# EAGLE board UCirKitBreadboardBottom-0824 (EAGLE 6.5.0), part 1 of 4
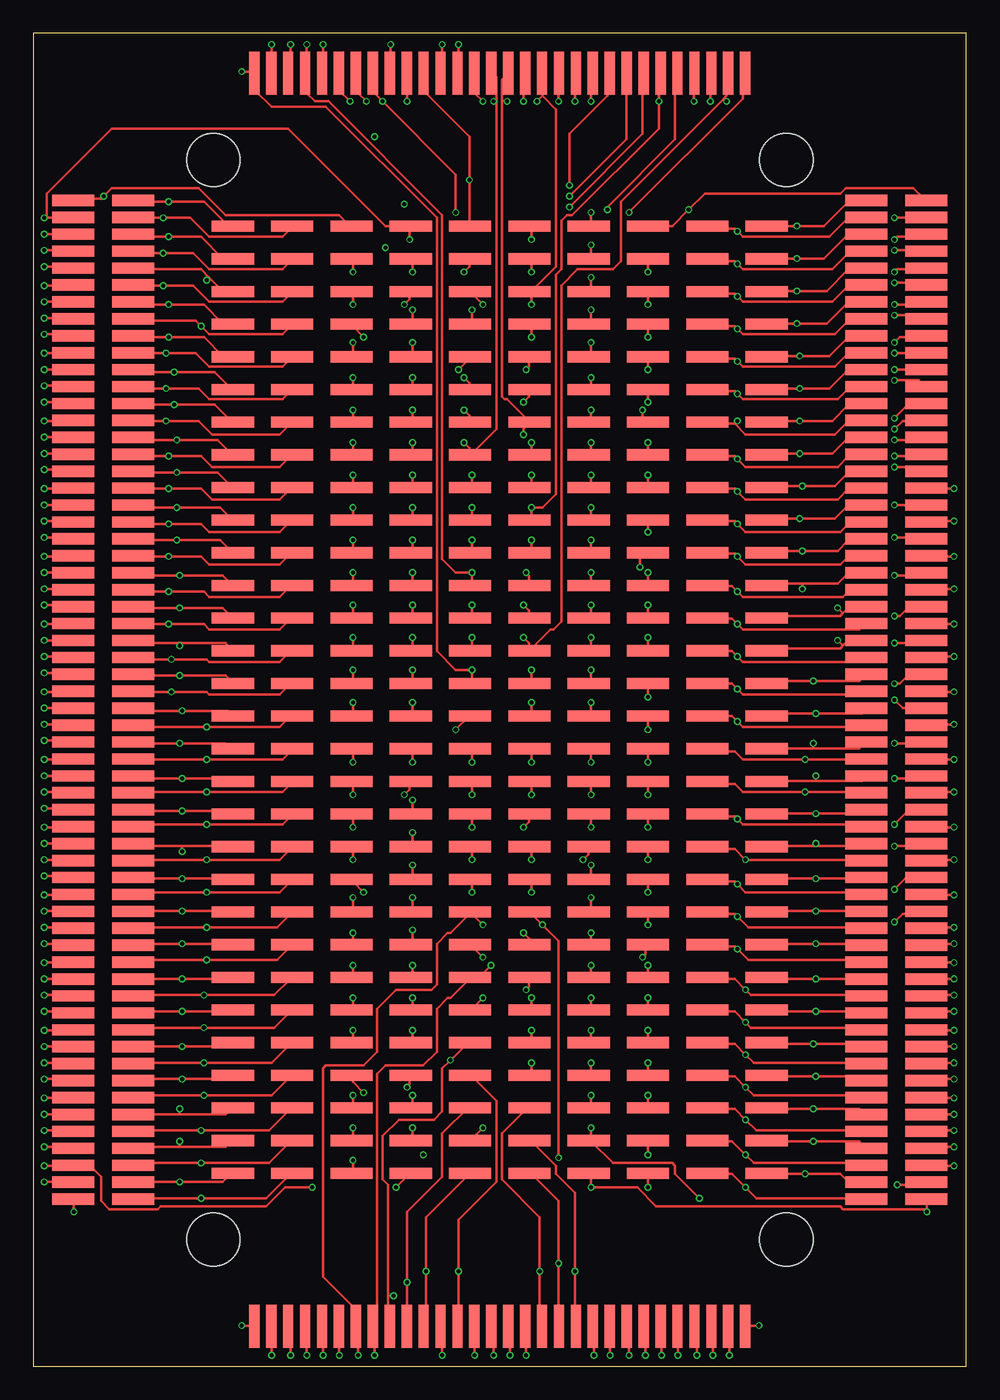
[diagram p5: board, top side]
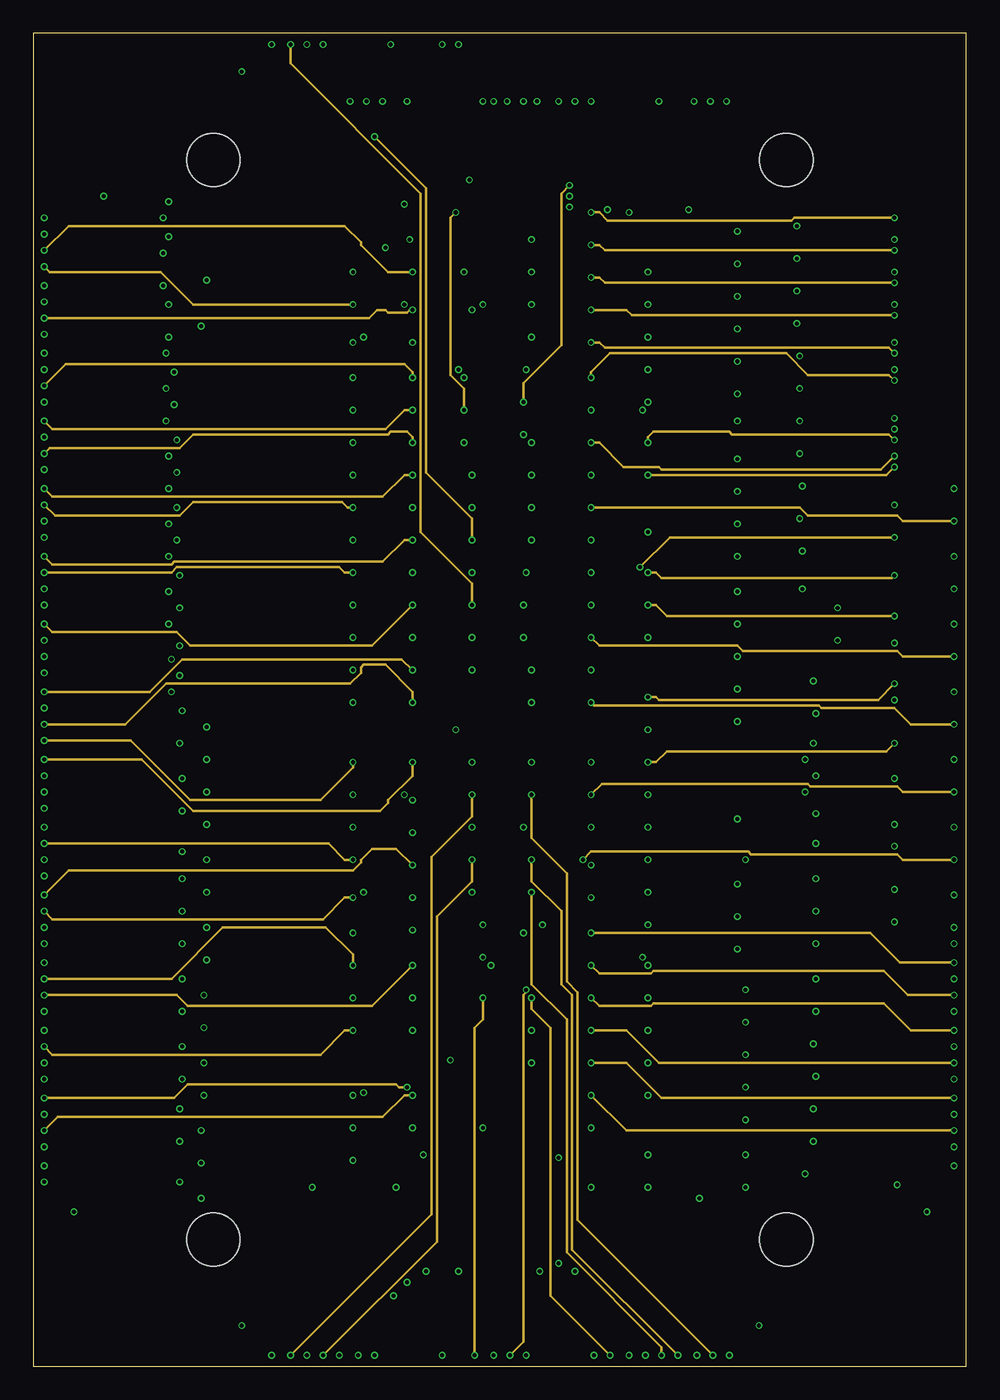
[diagram p6: board, inner layer Route2]
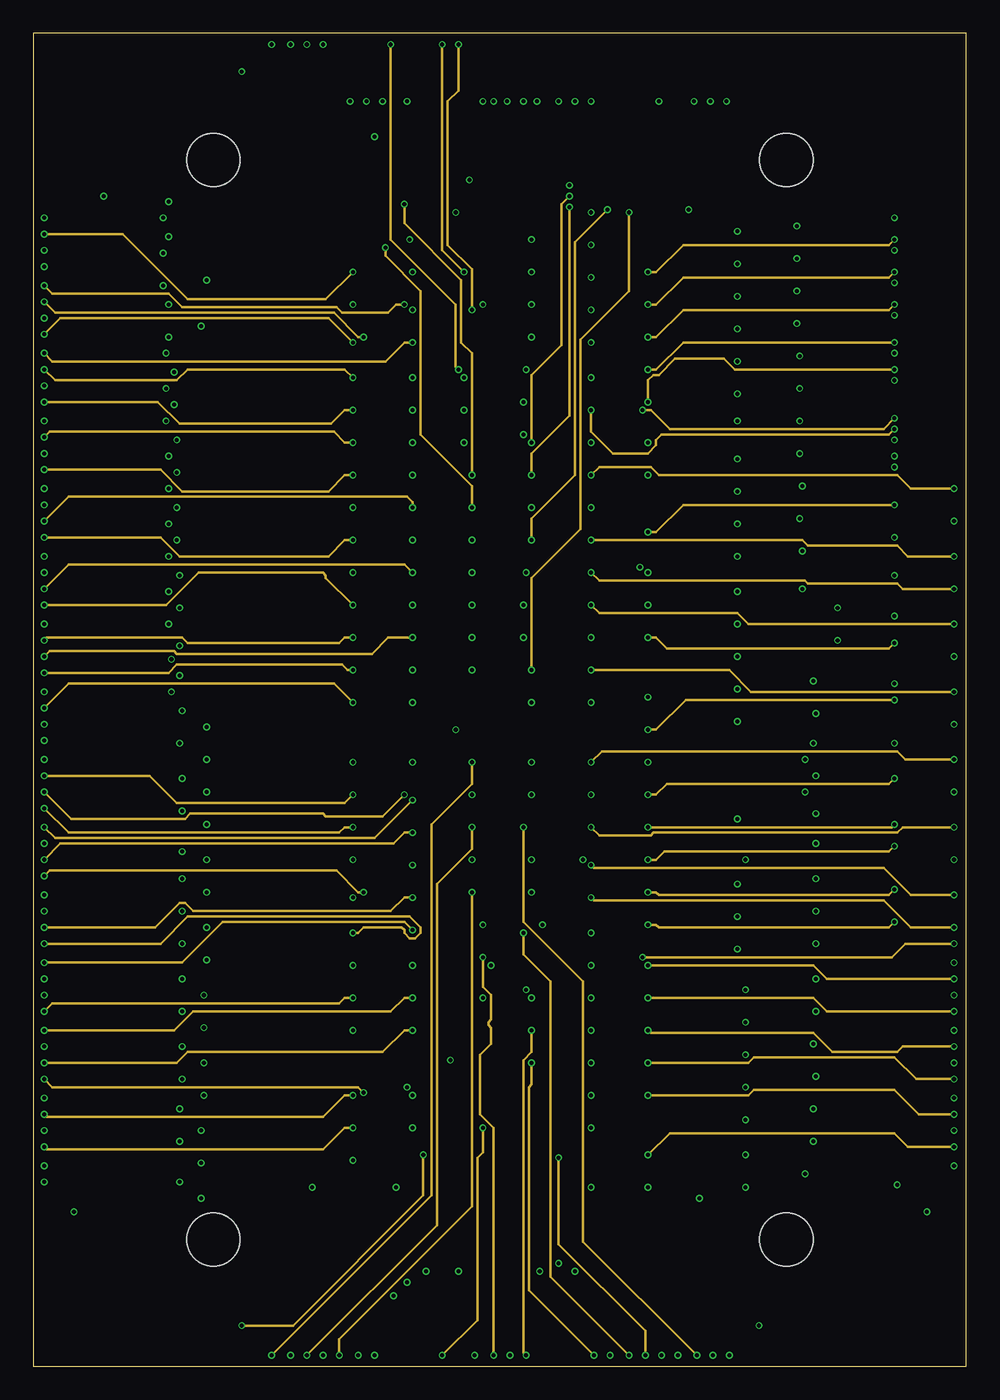
[diagram p7: board, inner layer Route15]
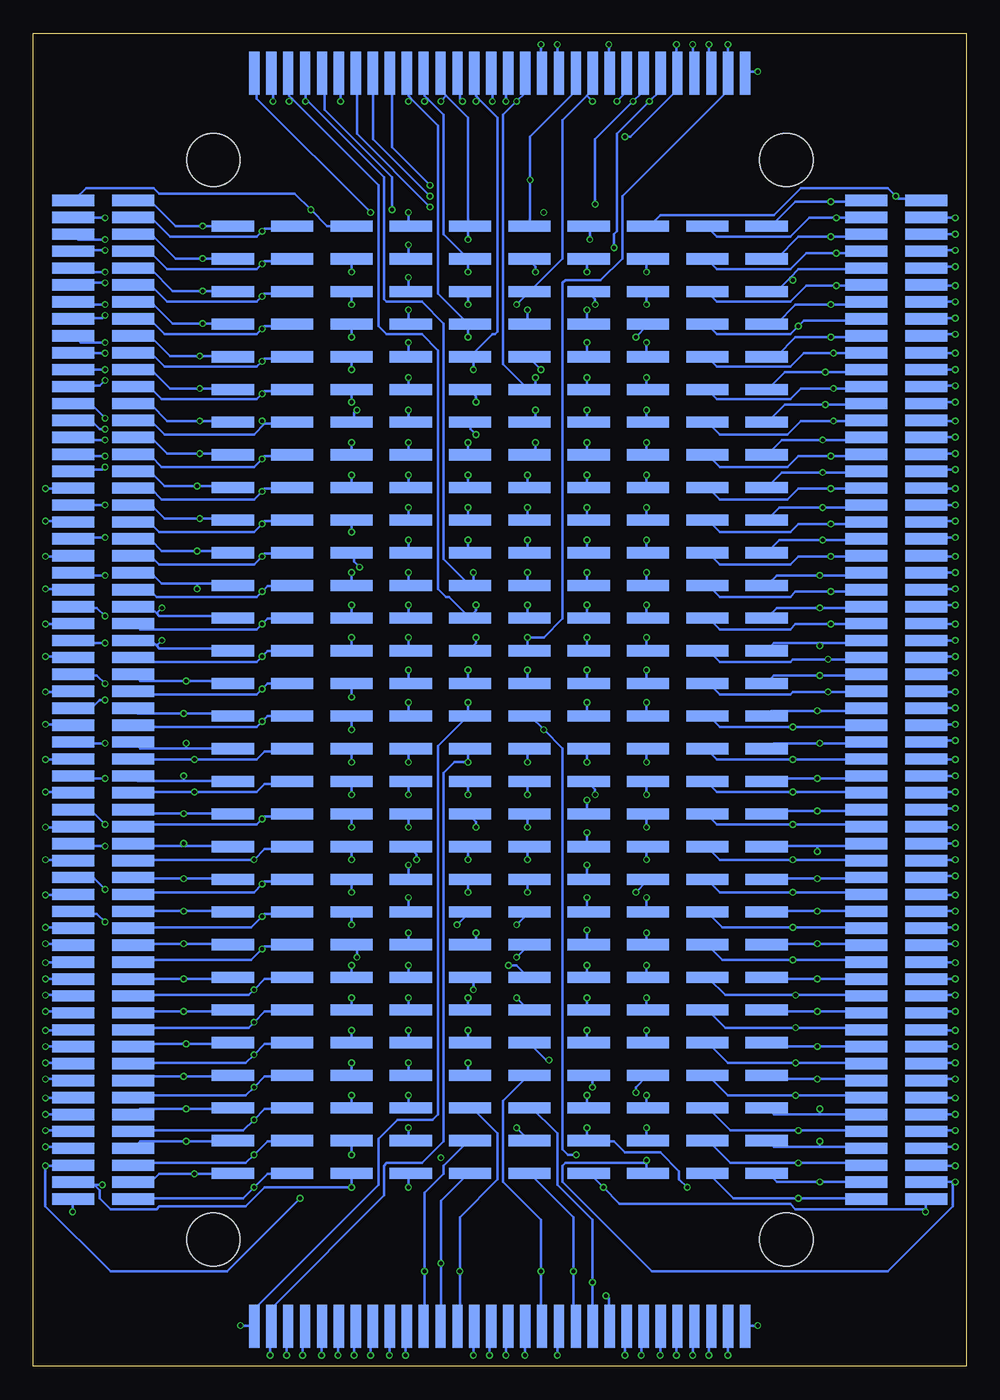
[diagram p8: board, bottom side, seen from below]

Size 70 x 100 mm. Coordinates in mm from the lower left corner, seen from the top.
Outline: 0,0 70,0 70,100 0,100 0,0
Copper layers (1*2*15*16): Top 0.035mm / dielectric 0.2mm / Route2 0.0175mm / dielectric 0.3mm / Route15 0.0175mm / dielectric 0.2mm / Bottom 0.035mm
Design rules "SeeedStudio_4layer_DRU_no_angle_20140221": minimum track width 8mil, minimum drill 12mil, track to track 8mil, track to pad 8mil, pad to pad 8mil, via to via 8mil, smd to smd 0mil, copper to edge 10mil, drill to drill 8mil, minimum pad ring 6mil, minimum via ring 4mil, stop-mask expansion 4mil, vias tented up to drill 100mil, thermal gap 10mil
Holes 4 mm at 13.5,9.5 13.5,90.5 56.5,90.5 56.5,9.5

## Footprints (pad centres in the part's own frame; a part is rotated, then mirrored left to right if it is on the bottom)
1X01_SMD_3.25X0.85MM_NO_SILK = smd 3.25 x 0.85: P$1 0,0

## Placement (x,y rotation side)
JP301  [1X01_SMD_3.25X0.85MM_NO_SILK]  14.97,85.53 0 top
JP302  [1X01_SMD_3.25X0.85MM_NO_SILK]  19.43,85.53 0 top
JP303  [1X01_SMD_3.25X0.85MM_NO_SILK]  23.88,85.53 0 top
JP304  [1X01_SMD_3.25X0.85MM_NO_SILK]  28.32,85.53 0 top
JP305  [1X01_SMD_3.25X0.85MM_NO_SILK]  32.77,85.53 0 top
JP306  [1X01_SMD_3.25X0.85MM_NO_SILK]  37.23,85.53 0 top
JP307  [1X01_SMD_3.25X0.85MM_NO_SILK]  41.67,85.53 0 top
JP308  [1X01_SMD_3.25X0.85MM_NO_SILK]  46.12,85.53 0 top
JP309  [1X01_SMD_3.25X0.85MM_NO_SILK]  50.58,85.53 0 top
JP310  [1X01_SMD_3.25X0.85MM_NO_SILK]  55.02,85.53 0 top
JP311  [1X01_SMD_3.25X0.85MM_NO_SILK]  14.97,83.08 0 top
JP312  [1X01_SMD_3.25X0.85MM_NO_SILK]  19.43,83.08 0 top
JP313  [1X01_SMD_3.25X0.85MM_NO_SILK]  23.88,83.08 0 top
JP314  [1X01_SMD_3.25X0.85MM_NO_SILK]  28.32,83.08 0 top
JP315  [1X01_SMD_3.25X0.85MM_NO_SILK]  32.77,83.08 0 top
JP316  [1X01_SMD_3.25X0.85MM_NO_SILK]  37.23,83.08 0 top
JP317  [1X01_SMD_3.25X0.85MM_NO_SILK]  41.67,83.08 0 top
JP318  [1X01_SMD_3.25X0.85MM_NO_SILK]  46.12,83.08 0 top
JP319  [1X01_SMD_3.25X0.85MM_NO_SILK]  50.58,83.08 0 top
JP320  [1X01_SMD_3.25X0.85MM_NO_SILK]  55.02,83.08 0 top
JP321  [1X01_SMD_3.25X0.85MM_NO_SILK]  14.97,80.62 0 top
JP322  [1X01_SMD_3.25X0.85MM_NO_SILK]  19.43,80.62 0 top
JP323  [1X01_SMD_3.25X0.85MM_NO_SILK]  23.88,80.62 0 top
JP324  [1X01_SMD_3.25X0.85MM_NO_SILK]  28.32,80.62 0 top
JP325  [1X01_SMD_3.25X0.85MM_NO_SILK]  32.77,80.62 0 top
JP326  [1X01_SMD_3.25X0.85MM_NO_SILK]  37.23,80.62 0 top
JP327  [1X01_SMD_3.25X0.85MM_NO_SILK]  41.67,80.62 0 top
JP328  [1X01_SMD_3.25X0.85MM_NO_SILK]  46.12,80.62 0 top
JP329  [1X01_SMD_3.25X0.85MM_NO_SILK]  50.58,80.62 0 top
JP330  [1X01_SMD_3.25X0.85MM_NO_SILK]  55.02,80.62 0 top
JP331  [1X01_SMD_3.25X0.85MM_NO_SILK]  14.97,78.17 0 top
JP332  [1X01_SMD_3.25X0.85MM_NO_SILK]  19.43,78.17 0 top
JP333  [1X01_SMD_3.25X0.85MM_NO_SILK]  23.88,78.17 0 top
JP334  [1X01_SMD_3.25X0.85MM_NO_SILK]  28.32,78.17 0 top
JP335  [1X01_SMD_3.25X0.85MM_NO_SILK]  32.77,78.17 0 top
JP336  [1X01_SMD_3.25X0.85MM_NO_SILK]  37.23,78.17 0 top
JP337  [1X01_SMD_3.25X0.85MM_NO_SILK]  41.67,78.17 0 top
JP338  [1X01_SMD_3.25X0.85MM_NO_SILK]  46.12,78.17 0 top
JP339  [1X01_SMD_3.25X0.85MM_NO_SILK]  50.58,78.17 0 top
JP340  [1X01_SMD_3.25X0.85MM_NO_SILK]  55.02,78.17 0 top
JP341  [1X01_SMD_3.25X0.85MM_NO_SILK]  14.97,75.72 0 top
JP342  [1X01_SMD_3.25X0.85MM_NO_SILK]  19.43,75.72 0 top
JP343  [1X01_SMD_3.25X0.85MM_NO_SILK]  23.88,75.72 0 top
JP344  [1X01_SMD_3.25X0.85MM_NO_SILK]  28.32,75.72 0 top
JP345  [1X01_SMD_3.25X0.85MM_NO_SILK]  32.77,75.72 0 top
JP346  [1X01_SMD_3.25X0.85MM_NO_SILK]  37.23,75.72 0 top
JP347  [1X01_SMD_3.25X0.85MM_NO_SILK]  41.67,75.72 0 top
JP348  [1X01_SMD_3.25X0.85MM_NO_SILK]  46.12,75.72 0 top
JP349  [1X01_SMD_3.25X0.85MM_NO_SILK]  50.58,75.72 0 top
JP350  [1X01_SMD_3.25X0.85MM_NO_SILK]  55.02,75.72 0 top
JP351  [1X01_SMD_3.25X0.85MM_NO_SILK]  14.97,73.28 0 top
JP352  [1X01_SMD_3.25X0.85MM_NO_SILK]  19.43,73.28 0 top
JP353  [1X01_SMD_3.25X0.85MM_NO_SILK]  23.88,73.28 0 top
JP354  [1X01_SMD_3.25X0.85MM_NO_SILK]  28.32,73.28 0 top
JP355  [1X01_SMD_3.25X0.85MM_NO_SILK]  32.77,73.28 0 top
JP356  [1X01_SMD_3.25X0.85MM_NO_SILK]  37.23,73.28 0 top
JP357  [1X01_SMD_3.25X0.85MM_NO_SILK]  41.67,73.28 0 top
JP358  [1X01_SMD_3.25X0.85MM_NO_SILK]  46.12,73.28 0 top
JP359  [1X01_SMD_3.25X0.85MM_NO_SILK]  50.58,73.28 0 top
JP360  [1X01_SMD_3.25X0.85MM_NO_SILK]  55.02,73.28 0 top
JP361  [1X01_SMD_3.25X0.85MM_NO_SILK]  14.97,70.83 0 top
JP362  [1X01_SMD_3.25X0.85MM_NO_SILK]  19.43,70.83 0 top
JP363  [1X01_SMD_3.25X0.85MM_NO_SILK]  23.88,70.83 0 top
JP364  [1X01_SMD_3.25X0.85MM_NO_SILK]  28.32,70.83 0 top
JP365  [1X01_SMD_3.25X0.85MM_NO_SILK]  32.77,70.83 0 top
JP366  [1X01_SMD_3.25X0.85MM_NO_SILK]  37.23,70.83 0 top
JP367  [1X01_SMD_3.25X0.85MM_NO_SILK]  41.67,70.83 0 top
JP368  [1X01_SMD_3.25X0.85MM_NO_SILK]  46.12,70.83 0 top
JP369  [1X01_SMD_3.25X0.85MM_NO_SILK]  50.58,70.83 0 top
JP370  [1X01_SMD_3.25X0.85MM_NO_SILK]  55.02,70.83 0 top
JP371  [1X01_SMD_3.25X0.85MM_NO_SILK]  14.97,68.38 0 top
JP372  [1X01_SMD_3.25X0.85MM_NO_SILK]  19.43,68.38 0 top
JP373  [1X01_SMD_3.25X0.85MM_NO_SILK]  23.88,68.38 0 top
JP374  [1X01_SMD_3.25X0.85MM_NO_SILK]  28.32,68.38 0 top
JP375  [1X01_SMD_3.25X0.85MM_NO_SILK]  32.77,68.38 0 top
JP376  [1X01_SMD_3.25X0.85MM_NO_SILK]  37.23,68.38 0 top
JP377  [1X01_SMD_3.25X0.85MM_NO_SILK]  41.67,68.38 0 top
JP378  [1X01_SMD_3.25X0.85MM_NO_SILK]  46.12,68.38 0 top
JP379  [1X01_SMD_3.25X0.85MM_NO_SILK]  50.58,68.38 0 top
JP380  [1X01_SMD_3.25X0.85MM_NO_SILK]  55.02,68.38 0 top
JP381  [1X01_SMD_3.25X0.85MM_NO_SILK]  14.97,65.92 0 top
JP382  [1X01_SMD_3.25X0.85MM_NO_SILK]  19.43,65.92 0 top
JP383  [1X01_SMD_3.25X0.85MM_NO_SILK]  23.88,65.92 0 top
JP384  [1X01_SMD_3.25X0.85MM_NO_SILK]  28.32,65.92 0 top
JP385  [1X01_SMD_3.25X0.85MM_NO_SILK]  32.77,65.92 0 top
JP386  [1X01_SMD_3.25X0.85MM_NO_SILK]  37.23,65.92 0 top
JP387  [1X01_SMD_3.25X0.85MM_NO_SILK]  41.67,65.92 0 top
JP388  [1X01_SMD_3.25X0.85MM_NO_SILK]  46.12,65.92 0 top
JP389  [1X01_SMD_3.25X0.85MM_NO_SILK]  50.58,65.92 0 top
JP390  [1X01_SMD_3.25X0.85MM_NO_SILK]  55.02,65.92 0 top
JP391  [1X01_SMD_3.25X0.85MM_NO_SILK]  14.97,63.48 0 top
JP392  [1X01_SMD_3.25X0.85MM_NO_SILK]  19.43,63.48 0 top
JP393  [1X01_SMD_3.25X0.85MM_NO_SILK]  23.88,63.48 0 top
JP394  [1X01_SMD_3.25X0.85MM_NO_SILK]  28.32,63.48 0 top
JP395  [1X01_SMD_3.25X0.85MM_NO_SILK]  32.77,63.48 0 top
JP396  [1X01_SMD_3.25X0.85MM_NO_SILK]  37.23,63.48 0 top
JP397  [1X01_SMD_3.25X0.85MM_NO_SILK]  41.67,63.48 0 top
JP398  [1X01_SMD_3.25X0.85MM_NO_SILK]  46.12,63.48 0 top
JP399  [1X01_SMD_3.25X0.85MM_NO_SILK]  50.58,63.48 0 top
JP400  [1X01_SMD_3.25X0.85MM_NO_SILK]  55.02,63.48 0 top
JP401  [1X01_SMD_3.25X0.85MM_NO_SILK]  14.97,61.02 0 top
JP402  [1X01_SMD_3.25X0.85MM_NO_SILK]  19.43,61.02 0 top
JP403  [1X01_SMD_3.25X0.85MM_NO_SILK]  23.88,61.02 0 top
JP404  [1X01_SMD_3.25X0.85MM_NO_SILK]  28.32,61.02 0 top
JP405  [1X01_SMD_3.25X0.85MM_NO_SILK]  32.77,61.02 0 top
JP406  [1X01_SMD_3.25X0.85MM_NO_SILK]  37.23,61.02 0 top
JP407  [1X01_SMD_3.25X0.85MM_NO_SILK]  41.67,61.02 0 top
JP408  [1X01_SMD_3.25X0.85MM_NO_SILK]  46.12,61.02 0 top
JP409  [1X01_SMD_3.25X0.85MM_NO_SILK]  50.58,61.02 0 top
JP410  [1X01_SMD_3.25X0.85MM_NO_SILK]  55.02,61.02 0 top
JP411  [1X01_SMD_3.25X0.85MM_NO_SILK]  14.97,58.58 0 top
JP412  [1X01_SMD_3.25X0.85MM_NO_SILK]  19.43,58.58 0 top
JP413  [1X01_SMD_3.25X0.85MM_NO_SILK]  23.88,58.58 0 top
JP414  [1X01_SMD_3.25X0.85MM_NO_SILK]  28.32,58.58 0 top
JP415  [1X01_SMD_3.25X0.85MM_NO_SILK]  32.77,58.58 0 top
JP416  [1X01_SMD_3.25X0.85MM_NO_SILK]  37.23,58.58 0 top
JP417  [1X01_SMD_3.25X0.85MM_NO_SILK]  41.67,58.58 0 top
JP418  [1X01_SMD_3.25X0.85MM_NO_SILK]  46.12,58.58 0 top
JP419  [1X01_SMD_3.25X0.85MM_NO_SILK]  50.58,58.58 0 top
JP420  [1X01_SMD_3.25X0.85MM_NO_SILK]  55.02,58.58 0 top
JP421  [1X01_SMD_3.25X0.85MM_NO_SILK]  14.97,56.12 0 top
JP422  [1X01_SMD_3.25X0.85MM_NO_SILK]  19.43,56.12 0 top
JP423  [1X01_SMD_3.25X0.85MM_NO_SILK]  23.88,56.12 0 top
JP424  [1X01_SMD_3.25X0.85MM_NO_SILK]  28.32,56.12 0 top
JP425  [1X01_SMD_3.25X0.85MM_NO_SILK]  32.77,56.12 0 top
JP426  [1X01_SMD_3.25X0.85MM_NO_SILK]  37.23,56.12 0 top
JP427  [1X01_SMD_3.25X0.85MM_NO_SILK]  41.67,56.12 0 top
JP428  [1X01_SMD_3.25X0.85MM_NO_SILK]  46.12,56.12 0 top
JP429  [1X01_SMD_3.25X0.85MM_NO_SILK]  50.58,56.12 0 top
JP430  [1X01_SMD_3.25X0.85MM_NO_SILK]  55.02,56.12 0 top
JP431  [1X01_SMD_3.25X0.85MM_NO_SILK]  14.97,53.67 0 top
JP432  [1X01_SMD_3.25X0.85MM_NO_SILK]  19.43,53.67 0 top
JP433  [1X01_SMD_3.25X0.85MM_NO_SILK]  23.88,53.67 0 top
JP434  [1X01_SMD_3.25X0.85MM_NO_SILK]  28.32,53.67 0 top
JP435  [1X01_SMD_3.25X0.85MM_NO_SILK]  32.77,53.67 0 top
JP436  [1X01_SMD_3.25X0.85MM_NO_SILK]  37.23,53.67 0 top
JP437  [1X01_SMD_3.25X0.85MM_NO_SILK]  41.67,53.67 0 top
JP438  [1X01_SMD_3.25X0.85MM_NO_SILK]  46.12,53.67 0 top
JP439  [1X01_SMD_3.25X0.85MM_NO_SILK]  50.58,53.67 0 top
JP440  [1X01_SMD_3.25X0.85MM_NO_SILK]  55.02,53.67 0 top
JP441  [1X01_SMD_3.25X0.85MM_NO_SILK]  14.97,51.23 0 top
JP442  [1X01_SMD_3.25X0.85MM_NO_SILK]  19.43,51.23 0 top
JP443  [1X01_SMD_3.25X0.85MM_NO_SILK]  23.88,51.23 0 top
JP444  [1X01_SMD_3.25X0.85MM_NO_SILK]  28.32,51.23 0 top
JP445  [1X01_SMD_3.25X0.85MM_NO_SILK]  32.77,51.23 0 top
JP446  [1X01_SMD_3.25X0.85MM_NO_SILK]  37.23,51.23 0 top
JP447  [1X01_SMD_3.25X0.85MM_NO_SILK]  41.67,51.23 0 top
JP448  [1X01_SMD_3.25X0.85MM_NO_SILK]  46.12,51.23 0 top
JP449  [1X01_SMD_3.25X0.85MM_NO_SILK]  50.58,51.23 0 top
JP450  [1X01_SMD_3.25X0.85MM_NO_SILK]  55.02,51.23 0 top
JP451  [1X01_SMD_3.25X0.85MM_NO_SILK]  14.97,48.77 0 top
JP452  [1X01_SMD_3.25X0.85MM_NO_SILK]  19.43,48.77 0 top
JP453  [1X01_SMD_3.25X0.85MM_NO_SILK]  23.88,48.77 0 top
JP454  [1X01_SMD_3.25X0.85MM_NO_SILK]  28.32,48.77 0 top
JP455  [1X01_SMD_3.25X0.85MM_NO_SILK]  32.77,48.77 0 top
JP456  [1X01_SMD_3.25X0.85MM_NO_SILK]  37.23,48.77 0 top
JP457  [1X01_SMD_3.25X0.85MM_NO_SILK]  41.67,48.77 0 top
JP458  [1X01_SMD_3.25X0.85MM_NO_SILK]  46.12,48.77 0 top
JP459  [1X01_SMD_3.25X0.85MM_NO_SILK]  50.58,48.77 0 top
JP460  [1X01_SMD_3.25X0.85MM_NO_SILK]  55.02,48.77 0 top
JP461  [1X01_SMD_3.25X0.85MM_NO_SILK]  14.97,46.33 0 top
JP462  [1X01_SMD_3.25X0.85MM_NO_SILK]  19.43,46.33 0 top
JP463  [1X01_SMD_3.25X0.85MM_NO_SILK]  23.88,46.33 0 top
JP464  [1X01_SMD_3.25X0.85MM_NO_SILK]  28.32,46.33 0 top
JP465  [1X01_SMD_3.25X0.85MM_NO_SILK]  32.77,46.33 0 top
JP466  [1X01_SMD_3.25X0.85MM_NO_SILK]  37.23,46.33 0 top
JP467  [1X01_SMD_3.25X0.85MM_NO_SILK]  41.67,46.33 0 top
JP468  [1X01_SMD_3.25X0.85MM_NO_SILK]  46.12,46.33 0 top
JP469  [1X01_SMD_3.25X0.85MM_NO_SILK]  50.58,46.33 0 top
JP470  [1X01_SMD_3.25X0.85MM_NO_SILK]  55.02,46.33 0 top
JP471  [1X01_SMD_3.25X0.85MM_NO_SILK]  14.97,43.88 0 top
JP472  [1X01_SMD_3.25X0.85MM_NO_SILK]  19.43,43.88 0 top
JP473  [1X01_SMD_3.25X0.85MM_NO_SILK]  23.88,43.88 0 top
JP474  [1X01_SMD_3.25X0.85MM_NO_SILK]  28.32,43.88 0 top
JP475  [1X01_SMD_3.25X0.85MM_NO_SILK]  32.77,43.88 0 top
JP476  [1X01_SMD_3.25X0.85MM_NO_SILK]  37.23,43.88 0 top
JP477  [1X01_SMD_3.25X0.85MM_NO_SILK]  41.67,43.88 0 top
JP478  [1X01_SMD_3.25X0.85MM_NO_SILK]  46.12,43.88 0 top
JP479  [1X01_SMD_3.25X0.85MM_NO_SILK]  50.58,43.88 0 top
JP480  [1X01_SMD_3.25X0.85MM_NO_SILK]  55.02,43.88 0 top
JP481  [1X01_SMD_3.25X0.85MM_NO_SILK]  14.97,41.42 0 top
JP482  [1X01_SMD_3.25X0.85MM_NO_SILK]  19.43,41.42 0 top
JP483  [1X01_SMD_3.25X0.85MM_NO_SILK]  23.88,41.42 0 top
JP484  [1X01_SMD_3.25X0.85MM_NO_SILK]  28.32,41.42 0 top
JP485  [1X01_SMD_3.25X0.85MM_NO_SILK]  32.77,41.42 0 top
JP486  [1X01_SMD_3.25X0.85MM_NO_SILK]  37.23,41.42 0 top
JP487  [1X01_SMD_3.25X0.85MM_NO_SILK]  41.67,41.42 0 top
JP488  [1X01_SMD_3.25X0.85MM_NO_SILK]  46.12,41.42 0 top
JP489  [1X01_SMD_3.25X0.85MM_NO_SILK]  50.58,41.42 0 top
JP490  [1X01_SMD_3.25X0.85MM_NO_SILK]  55.02,41.42 0 top
JP491  [1X01_SMD_3.25X0.85MM_NO_SILK]  14.97,38.98 0 top
JP492  [1X01_SMD_3.25X0.85MM_NO_SILK]  19.43,38.98 0 top
JP493  [1X01_SMD_3.25X0.85MM_NO_SILK]  23.88,38.98 0 top
JP494  [1X01_SMD_3.25X0.85MM_NO_SILK]  28.32,38.98 0 top
JP495  [1X01_SMD_3.25X0.85MM_NO_SILK]  32.77,38.98 0 top
JP496  [1X01_SMD_3.25X0.85MM_NO_SILK]  37.23,38.98 0 top
JP497  [1X01_SMD_3.25X0.85MM_NO_SILK]  41.67,38.98 0 top
JP498  [1X01_SMD_3.25X0.85MM_NO_SILK]  46.12,38.98 0 top
JP499  [1X01_SMD_3.25X0.85MM_NO_SILK]  50.58,38.98 0 top
JP500  [1X01_SMD_3.25X0.85MM_NO_SILK]  55.02,38.98 0 top
JP501  [1X01_SMD_3.25X0.85MM_NO_SILK]  14.97,36.52 0 top
JP502  [1X01_SMD_3.25X0.85MM_NO_SILK]  19.43,36.52 0 top
JP503  [1X01_SMD_3.25X0.85MM_NO_SILK]  23.88,36.52 0 top
JP504  [1X01_SMD_3.25X0.85MM_NO_SILK]  28.32,36.52 0 top
JP505  [1X01_SMD_3.25X0.85MM_NO_SILK]  32.77,36.52 0 top
JP506  [1X01_SMD_3.25X0.85MM_NO_SILK]  37.23,36.52 0 top
JP507  [1X01_SMD_3.25X0.85MM_NO_SILK]  41.67,36.52 0 top
JP508  [1X01_SMD_3.25X0.85MM_NO_SILK]  46.12,36.52 0 top
JP509  [1X01_SMD_3.25X0.85MM_NO_SILK]  50.58,36.52 0 top
JP510  [1X01_SMD_3.25X0.85MM_NO_SILK]  55.02,36.52 0 top
JP511  [1X01_SMD_3.25X0.85MM_NO_SILK]  14.97,34.08 0 top
JP512  [1X01_SMD_3.25X0.85MM_NO_SILK]  19.43,34.08 0 top
JP513  [1X01_SMD_3.25X0.85MM_NO_SILK]  23.88,34.08 0 top
JP514  [1X01_SMD_3.25X0.85MM_NO_SILK]  28.32,34.08 0 top
JP515  [1X01_SMD_3.25X0.85MM_NO_SILK]  32.77,34.08 0 top
JP516  [1X01_SMD_3.25X0.85MM_NO_SILK]  37.23,34.08 0 top
JP517  [1X01_SMD_3.25X0.85MM_NO_SILK]  41.67,34.08 0 top
JP518  [1X01_SMD_3.25X0.85MM_NO_SILK]  46.12,34.08 0 top
JP519  [1X01_SMD_3.25X0.85MM_NO_SILK]  50.58,34.08 0 top
JP520  [1X01_SMD_3.25X0.85MM_NO_SILK]  55.02,34.08 0 top
JP521  [1X01_SMD_3.25X0.85MM_NO_SILK]  14.97,31.62 0 top
JP522  [1X01_SMD_3.25X0.85MM_NO_SILK]  19.43,31.62 0 top
JP523  [1X01_SMD_3.25X0.85MM_NO_SILK]  23.88,31.62 0 top
JP524  [1X01_SMD_3.25X0.85MM_NO_SILK]  28.32,31.62 0 top
JP525  [1X01_SMD_3.25X0.85MM_NO_SILK]  32.77,31.62 0 top
JP526  [1X01_SMD_3.25X0.85MM_NO_SILK]  37.23,31.62 0 top
JP527  [1X01_SMD_3.25X0.85MM_NO_SILK]  41.67,31.62 0 top
JP528  [1X01_SMD_3.25X0.85MM_NO_SILK]  46.12,31.62 0 top
JP529  [1X01_SMD_3.25X0.85MM_NO_SILK]  50.58,31.62 0 top
JP530  [1X01_SMD_3.25X0.85MM_NO_SILK]  55.02,31.62 0 top
JP531  [1X01_SMD_3.25X0.85MM_NO_SILK]  14.97,29.18 0 top
JP532  [1X01_SMD_3.25X0.85MM_NO_SILK]  19.43,29.18 0 top
JP533  [1X01_SMD_3.25X0.85MM_NO_SILK]  23.88,29.18 0 top
JP534  [1X01_SMD_3.25X0.85MM_NO_SILK]  28.32,29.18 0 top
JP535  [1X01_SMD_3.25X0.85MM_NO_SILK]  32.77,29.18 0 top
JP536  [1X01_SMD_3.25X0.85MM_NO_SILK]  37.23,29.18 0 top
JP537  [1X01_SMD_3.25X0.85MM_NO_SILK]  41.67,29.18 0 top
JP538  [1X01_SMD_3.25X0.85MM_NO_SILK]  46.12,29.18 0 top
JP539  [1X01_SMD_3.25X0.85MM_NO_SILK]  50.58,29.18 0 top
JP540  [1X01_SMD_3.25X0.85MM_NO_SILK]  55.02,29.18 0 top
JP541  [1X01_SMD_3.25X0.85MM_NO_SILK]  14.97,26.73 0 top
JP542  [1X01_SMD_3.25X0.85MM_NO_SILK]  19.43,26.73 0 top
JP543  [1X01_SMD_3.25X0.85MM_NO_SILK]  23.88,26.73 0 top
JP544  [1X01_SMD_3.25X0.85MM_NO_SILK]  28.32,26.73 0 top
JP545  [1X01_SMD_3.25X0.85MM_NO_SILK]  32.77,26.73 0 top
JP546  [1X01_SMD_3.25X0.85MM_NO_SILK]  37.23,26.73 0 top
JP547  [1X01_SMD_3.25X0.85MM_NO_SILK]  41.67,26.73 0 top
JP548  [1X01_SMD_3.25X0.85MM_NO_SILK]  46.12,26.73 0 top
JP549  [1X01_SMD_3.25X0.85MM_NO_SILK]  50.58,26.73 0 top
JP550  [1X01_SMD_3.25X0.85MM_NO_SILK]  55.02,26.73 0 top
JP551  [1X01_SMD_3.25X0.85MM_NO_SILK]  14.97,24.27 0 top
JP552  [1X01_SMD_3.25X0.85MM_NO_SILK]  19.43,24.27 0 top
JP553  [1X01_SMD_3.25X0.85MM_NO_SILK]  23.88,24.27 0 top
JP554  [1X01_SMD_3.25X0.85MM_NO_SILK]  28.32,24.27 0 top
JP555  [1X01_SMD_3.25X0.85MM_NO_SILK]  32.77,24.27 0 top
JP556  [1X01_SMD_3.25X0.85MM_NO_SILK]  37.23,24.27 0 top
JP557  [1X01_SMD_3.25X0.85MM_NO_SILK]  41.67,24.27 0 top
JP558  [1X01_SMD_3.25X0.85MM_NO_SILK]  46.12,24.27 0 top
JP559  [1X01_SMD_3.25X0.85MM_NO_SILK]  50.58,24.27 0 top
JP560  [1X01_SMD_3.25X0.85MM_NO_SILK]  55.02,24.27 0 top
JP561  [1X01_SMD_3.25X0.85MM_NO_SILK]  14.97,21.82 0 top
JP562  [1X01_SMD_3.25X0.85MM_NO_SILK]  19.43,21.82 0 top
JP563  [1X01_SMD_3.25X0.85MM_NO_SILK]  23.88,21.82 0 top
JP564  [1X01_SMD_3.25X0.85MM_NO_SILK]  28.32,21.82 0 top
JP565  [1X01_SMD_3.25X0.85MM_NO_SILK]  32.77,21.82 0 top
JP566  [1X01_SMD_3.25X0.85MM_NO_SILK]  37.23,21.82 0 top
JP567  [1X01_SMD_3.25X0.85MM_NO_SILK]  41.67,21.82 0 top
JP568  [1X01_SMD_3.25X0.85MM_NO_SILK]  46.12,21.82 0 top
JP569  [1X01_SMD_3.25X0.85MM_NO_SILK]  50.58,21.82 0 top
JP570  [1X01_SMD_3.25X0.85MM_NO_SILK]  55.02,21.82 0 top
JP571  [1X01_SMD_3.25X0.85MM_NO_SILK]  14.97,19.38 0 top
JP572  [1X01_SMD_3.25X0.85MM_NO_SILK]  19.43,19.38 0 top
JP573  [1X01_SMD_3.25X0.85MM_NO_SILK]  23.88,19.38 0 top
JP574  [1X01_SMD_3.25X0.85MM_NO_SILK]  28.32,19.38 0 top
JP575  [1X01_SMD_3.25X0.85MM_NO_SILK]  32.77,19.38 0 top
JP576  [1X01_SMD_3.25X0.85MM_NO_SILK]  37.23,19.38 0 top
JP577  [1X01_SMD_3.25X0.85MM_NO_SILK]  41.67,19.38 0 top
JP578  [1X01_SMD_3.25X0.85MM_NO_SILK]  46.12,19.38 0 top
JP579  [1X01_SMD_3.25X0.85MM_NO_SILK]  50.58,19.38 0 top
JP580  [1X01_SMD_3.25X0.85MM_NO_SILK]  55.02,19.38 0 top
JP581  [1X01_SMD_3.25X0.85MM_NO_SILK]  14.97,16.93 0 top
JP582  [1X01_SMD_3.25X0.85MM_NO_SILK]  19.43,16.93 0 top
JP583  [1X01_SMD_3.25X0.85MM_NO_SILK]  23.88,16.93 0 top
JP584  [1X01_SMD_3.25X0.85MM_NO_SILK]  28.32,16.93 0 top
JP585  [1X01_SMD_3.25X0.85MM_NO_SILK]  32.77,16.93 0 top
JP586  [1X01_SMD_3.25X0.85MM_NO_SILK]  37.23,16.93 0 top
JP587  [1X01_SMD_3.25X0.85MM_NO_SILK]  41.67,16.93 0 top
JP588  [1X01_SMD_3.25X0.85MM_NO_SILK]  46.12,16.93 0 top
JP589  [1X01_SMD_3.25X0.85MM_NO_SILK]  50.58,16.93 0 top
JP590  [1X01_SMD_3.25X0.85MM_NO_SILK]  55.02,16.93 0 top
JP591  [1X01_SMD_3.25X0.85MM_NO_SILK]  14.97,14.47 0 top
JP592  [1X01_SMD_3.25X0.85MM_NO_SILK]  19.43,14.47 0 top
JP593  [1X01_SMD_3.25X0.85MM_NO_SILK]  23.88,14.47 0 top
JP594  [1X01_SMD_3.25X0.85MM_NO_SILK]  28.32,14.47 0 top
JP595  [1X01_SMD_3.25X0.85MM_NO_SILK]  32.77,14.47 0 top
JP596  [1X01_SMD_3.25X0.85MM_NO_SILK]  37.23,14.47 0 top
JP597  [1X01_SMD_3.25X0.85MM_NO_SILK]  41.67,14.47 0 top
JP598  [1X01_SMD_3.25X0.85MM_NO_SILK]  46.12,14.47 0 top
JP599  [1X01_SMD_3.25X0.85MM_NO_SILK]  50.58,14.47 0 top
JP600  [1X01_SMD_3.25X0.85MM_NO_SILK]  55.02,14.47 0 top
JP601  [1X01_SMD_3.25X0.85MM_NO_SILK]  14.97,85.53 0 bottom
JP602  [1X01_SMD_3.25X0.85MM_NO_SILK]  19.43,85.53 0 bottom
JP603  [1X01_SMD_3.25X0.85MM_NO_SILK]  23.88,85.53 0 bottom
JP604  [1X01_SMD_3.25X0.85MM_NO_SILK]  28.32,85.53 0 bottom
JP605  [1X01_SMD_3.25X0.85MM_NO_SILK]  32.77,85.53 0 bottom
JP606  [1X01_SMD_3.25X0.85MM_NO_SILK]  37.23,85.53 0 bottom
JP607  [1X01_SMD_3.25X0.85MM_NO_SILK]  41.67,85.53 0 bottom
JP608  [1X01_SMD_3.25X0.85MM_NO_SILK]  46.12,85.53 0 bottom
JP609  [1X01_SMD_3.25X0.85MM_NO_SILK]  50.58,85.53 0 bottom
JP610  [1X01_SMD_3.25X0.85MM_NO_SILK]  55.02,85.53 0 bottom
JP611  [1X01_SMD_3.25X0.85MM_NO_SILK]  14.97,83.08 0 bottom
JP612  [1X01_SMD_3.25X0.85MM_NO_SILK]  19.43,83.08 0 bottom
JP613  [1X01_SMD_3.25X0.85MM_NO_SILK]  23.88,83.08 0 bottom
JP614  [1X01_SMD_3.25X0.85MM_NO_SILK]  28.32,83.08 0 bottom
JP615  [1X01_SMD_3.25X0.85MM_NO_SILK]  32.77,83.08 0 bottom
JP616  [1X01_SMD_3.25X0.85MM_NO_SILK]  37.23,83.08 0 bottom
JP617  [1X01_SMD_3.25X0.85MM_NO_SILK]  41.67,83.08 0 bottom
JP618  [1X01_SMD_3.25X0.85MM_NO_SILK]  46.12,83.08 0 bottom
JP619  [1X01_SMD_3.25X0.85MM_NO_SILK]  50.58,83.08 0 bottom
JP620  [1X01_SMD_3.25X0.85MM_NO_SILK]  55.02,83.08 0 bottom
JP621  [1X01_SMD_3.25X0.85MM_NO_SILK]  14.97,80.62 0 bottom
JP622  [1X01_SMD_3.25X0.85MM_NO_SILK]  19.43,80.62 0 bottom
JP623  [1X01_SMD_3.25X0.85MM_NO_SILK]  23.88,80.62 0 bottom
JP624  [1X01_SMD_3.25X0.85MM_NO_SILK]  28.32,80.62 0 bottom
JP625  [1X01_SMD_3.25X0.85MM_NO_SILK]  32.77,80.62 0 bottom
JP626  [1X01_SMD_3.25X0.85MM_NO_SILK]  37.23,80.62 0 bottom
JP627  [1X01_SMD_3.25X0.85MM_NO_SILK]  41.67,80.62 0 bottom
JP628  [1X01_SMD_3.25X0.85MM_NO_SILK]  46.12,80.62 0 bottom
JP629  [1X01_SMD_3.25X0.85MM_NO_SILK]  50.58,80.62 0 bottom
JP630  [1X01_SMD_3.25X0.85MM_NO_SILK]  55.02,80.62 0 bottom
JP631  [1X01_SMD_3.25X0.85MM_NO_SILK]  14.97,78.17 0 bottom
JP632  [1X01_SMD_3.25X0.85MM_NO_SILK]  19.43,78.17 0 bottom
JP633  [1X01_SMD_3.25X0.85MM_NO_SILK]  23.88,78.17 0 bottom
JP634  [1X01_SMD_3.25X0.85MM_NO_SILK]  28.32,78.17 0 bottom
JP635  [1X01_SMD_3.25X0.85MM_NO_SILK]  32.77,78.17 0 bottom
JP636  [1X01_SMD_3.25X0.85MM_NO_SILK]  37.23,78.17 0 bottom
JP637  [1X01_SMD_3.25X0.85MM_NO_SILK]  41.67,78.17 0 bottom
JP638  [1X01_SMD_3.25X0.85MM_NO_SILK]  46.12,78.17 0 bottom
JP639  [1X01_SMD_3.25X0.85MM_NO_SILK]  50.58,78.17 0 bottom
JP640  [1X01_SMD_3.25X0.85MM_NO_SILK]  55.02,78.17 0 bottom
JP641  [1X01_SMD_3.25X0.85MM_NO_SILK]  14.97,75.72 0 bottom
JP642  [1X01_SMD_3.25X0.85MM_NO_SILK]  19.43,75.72 0 bottom
JP643  [1X01_SMD_3.25X0.85MM_NO_SILK]  23.88,75.72 0 bottom
JP644  [1X01_SMD_3.25X0.85MM_NO_SILK]  28.32,75.72 0 bottom
JP645  [1X01_SMD_3.25X0.85MM_NO_SILK]  32.77,75.72 0 bottom
JP646  [1X01_SMD_3.25X0.85MM_NO_SILK]  37.23,75.72 0 bottom
JP647  [1X01_SMD_3.25X0.85MM_NO_SILK]  41.67,75.72 0 bottom
JP648  [1X01_SMD_3.25X0.85MM_NO_SILK]  46.12,75.72 0 bottom
JP649  [1X01_SMD_3.25X0.85MM_NO_SILK]  50.58,75.72 0 bottom
JP650  [1X01_SMD_3.25X0.85MM_NO_SILK]  55.02,75.72 0 bottom
JP651  [1X01_SMD_3.25X0.85MM_NO_SILK]  14.97,73.28 0 bottom
JP652  [1X01_SMD_3.25X0.85MM_NO_SILK]  19.43,73.28 0 bottom
JP653  [1X01_SMD_3.25X0.85MM_NO_SILK]  23.88,73.28 0 bottom
JP654  [1X01_SMD_3.25X0.85MM_NO_SILK]  28.32,73.28 0 bottom
JP655  [1X01_SMD_3.25X0.85MM_NO_SILK]  32.77,73.28 0 bottom
JP656  [1X01_SMD_3.25X0.85MM_NO_SILK]  37.23,73.28 0 bottom
JP657  [1X01_SMD_3.25X0.85MM_NO_SILK]  41.67,73.28 0 bottom
JP658  [1X01_SMD_3.25X0.85MM_NO_SILK]  46.12,73.28 0 bottom
JP659  [1X01_SMD_3.25X0.85MM_NO_SILK]  50.58,73.28 0 bottom
JP660  [1X01_SMD_3.25X0.85MM_NO_SILK]  55.02,73.28 0 bottom
JP661  [1X01_SMD_3.25X0.85MM_NO_SILK]  14.97,70.83 0 bottom
JP662  [1X01_SMD_3.25X0.85MM_NO_SILK]  19.43,70.83 0 bottom
JP663  [1X01_SMD_3.25X0.85MM_NO_SILK]  23.88,70.83 0 bottom
JP664  [1X01_SMD_3.25X0.85MM_NO_SILK]  28.32,70.83 0 bottom
JP665  [1X01_SMD_3.25X0.85MM_NO_SILK]  32.77,70.83 0 bottom
JP666  [1X01_SMD_3.25X0.85MM_NO_SILK]  37.23,70.83 0 bottom
JP667  [1X01_SMD_3.25X0.85MM_NO_SILK]  41.67,70.83 0 bottom
JP668  [1X01_SMD_3.25X0.85MM_NO_SILK]  46.12,70.83 0 bottom
JP669  [1X01_SMD_3.25X0.85MM_NO_SILK]  50.58,70.83 0 bottom
JP670  [1X01_SMD_3.25X0.85MM_NO_SILK]  55.02,70.83 0 bottom
JP671  [1X01_SMD_3.25X0.85MM_NO_SILK]  14.97,68.38 0 bottom
JP672  [1X01_SMD_3.25X0.85MM_NO_SILK]  19.43,68.38 0 bottom
JP673  [1X01_SMD_3.25X0.85MM_NO_SILK]  23.88,68.38 0 bottom
JP674  [1X01_SMD_3.25X0.85MM_NO_SILK]  28.32,68.38 0 bottom
JP675  [1X01_SMD_3.25X0.85MM_NO_SILK]  32.77,68.38 0 bottom
JP676  [1X01_SMD_3.25X0.85MM_NO_SILK]  37.23,68.38 0 bottom
JP677  [1X01_SMD_3.25X0.85MM_NO_SILK]  41.67,68.38 0 bottom
JP678  [1X01_SMD_3.25X0.85MM_NO_SILK]  46.12,68.38 0 bottom
JP679  [1X01_SMD_3.25X0.85MM_NO_SILK]  50.58,68.38 0 bottom
JP680  [1X01_SMD_3.25X0.85MM_NO_SILK]  55.02,68.38 0 bottom
JP681  [1X01_SMD_3.25X0.85MM_NO_SILK]  14.97,65.92 0 bottom
JP682  [1X01_SMD_3.25X0.85MM_NO_SILK]  19.43,65.92 0 bottom
JP683  [1X01_SMD_3.25X0.85MM_NO_SILK]  23.88,65.92 0 bottom
JP684  [1X01_SMD_3.25X0.85MM_NO_SILK]  28.32,65.92 0 bottom
JP685  [1X01_SMD_3.25X0.85MM_NO_SILK]  32.77,65.92 0 bottom
JP686  [1X01_SMD_3.25X0.85MM_NO_SILK]  37.23,65.92 0 bottom
JP687  [1X01_SMD_3.25X0.85MM_NO_SILK]  41.67,65.92 0 bottom
JP688  [1X01_SMD_3.25X0.85MM_NO_SILK]  46.12,65.92 0 bottom
JP689  [1X01_SMD_3.25X0.85MM_NO_SILK]  50.58,65.92 0 bottom
JP690  [1X01_SMD_3.25X0.85MM_NO_SILK]  55.02,65.92 0 bottom
JP691  [1X01_SMD_3.25X0.85MM_NO_SILK]  14.97,63.48 0 bottom
JP692  [1X01_SMD_3.25X0.85MM_NO_SILK]  19.43,63.48 0 bottom
JP693  [1X01_SMD_3.25X0.85MM_NO_SILK]  23.88,63.48 0 bottom
JP694  [1X01_SMD_3.25X0.85MM_NO_SILK]  28.32,63.48 0 bottom
JP695  [1X01_SMD_3.25X0.85MM_NO_SILK]  32.77,63.48 0 bottom
JP696  [1X01_SMD_3.25X0.85MM_NO_SILK]  37.23,63.48 0 bottom
JP697  [1X01_SMD_3.25X0.85MM_NO_SILK]  41.67,63.48 0 bottom
JP698  [1X01_SMD_3.25X0.85MM_NO_SILK]  46.12,63.48 0 bottom
JP699  [1X01_SMD_3.25X0.85MM_NO_SILK]  50.58,63.48 0 bottom
JP700  [1X01_SMD_3.25X0.85MM_NO_SILK]  55.02,63.48 0 bottom
JP701  [1X01_SMD_3.25X0.85MM_NO_SILK]  14.97,61.02 0 bottom
JP702  [1X01_SMD_3.25X0.85MM_NO_SILK]  19.43,61.02 0 bottom
JP703  [1X01_SMD_3.25X0.85MM_NO_SILK]  23.88,61.02 0 bottom
JP704  [1X01_SMD_3.25X0.85MM_NO_SILK]  28.32,61.02 0 bottom
JP705  [1X01_SMD_3.25X0.85MM_NO_SILK]  32.77,61.02 0 bottom
JP706  [1X01_SMD_3.25X0.85MM_NO_SILK]  37.23,61.02 0 bottom
JP707  [1X01_SMD_3.25X0.85MM_NO_SILK]  41.67,61.02 0 bottom
JP708  [1X01_SMD_3.25X0.85MM_NO_SILK]  46.12,61.02 0 bottom
JP709  [1X01_SMD_3.25X0.85MM_NO_SILK]  50.58,61.02 0 bottom
JP710  [1X01_SMD_3.25X0.85MM_NO_SILK]  55.02,61.02 0 bottom
JP711  [1X01_SMD_3.25X0.85MM_NO_SILK]  14.97,58.58 0 bottom
JP712  [1X01_SMD_3.25X0.85MM_NO_SILK]  19.43,58.58 0 bottom
JP713  [1X01_SMD_3.25X0.85MM_NO_SILK]  23.88,58.58 0 bottom
JP714  [1X01_SMD_3.25X0.85MM_NO_SILK]  28.32,58.58 0 bottom
JP715  [1X01_SMD_3.25X0.85MM_NO_SILK]  32.77,58.58 0 bottom
JP716  [1X01_SMD_3.25X0.85MM_NO_SILK]  37.23,58.58 0 bottom
JP717  [1X01_SMD_3.25X0.85MM_NO_SILK]  41.67,58.58 0 bottom
JP718  [1X01_SMD_3.25X0.85MM_NO_SILK]  46.12,58.58 0 bottom
JP719  [1X01_SMD_3.25X0.85MM_NO_SILK]  50.58,58.58 0 bottom
JP720  [1X01_SMD_3.25X0.85MM_NO_SILK]  55.02,58.58 0 bottom
JP721  [1X01_SMD_3.25X0.85MM_NO_SILK]  14.97,56.12 0 bottom
JP722  [1X01_SMD_3.25X0.85MM_NO_SILK]  19.43,56.12 0 bottom
JP723  [1X01_SMD_3.25X0.85MM_NO_SILK]  23.88,56.12 0 bottom
JP724  [1X01_SMD_3.25X0.85MM_NO_SILK]  28.32,56.12 0 bottom
JP725  [1X01_SMD_3.25X0.85MM_NO_SILK]  32.77,56.12 0 bottom
JP726  [1X01_SMD_3.25X0.85MM_NO_SILK]  37.23,56.12 0 bottom
JP727  [1X01_SMD_3.25X0.85MM_NO_SILK]  41.67,56.12 0 bottom
JP728  [1X01_SMD_3.25X0.85MM_NO_SILK]  46.12,56.12 0 bottom
JP729  [1X01_SMD_3.25X0.85MM_NO_SILK]  50.58,56.12 0 bottom
JP730  [1X01_SMD_3.25X0.85MM_NO_SILK]  55.02,56.12 0 bottom
JP731  [1X01_SMD_3.25X0.85MM_NO_SILK]  14.97,53.67 0 bottom
JP732  [1X01_SMD_3.25X0.85MM_NO_SILK]  19.43,53.67 0 bottom
JP733  [1X01_SMD_3.25X0.85MM_NO_SILK]  23.88,53.67 0 bottom
JP734  [1X01_SMD_3.25X0.85MM_NO_SILK]  28.32,53.67 0 bottom
JP735  [1X01_SMD_3.25X0.85MM_NO_SILK]  32.77,53.67 0 bottom
JP736  [1X01_SMD_3.25X0.85MM_NO_SILK]  37.23,53.67 0 bottom
JP737  [1X01_SMD_3.25X0.85MM_NO_SILK]  41.67,53.67 0 bottom
JP738  [1X01_SMD_3.25X0.85MM_NO_SILK]  46.12,53.67 0 bottom
JP739  [1X01_SMD_3.25X0.85MM_NO_SILK]  50.58,53.67 0 bottom
JP740  [1X01_SMD_3.25X0.85MM_NO_SILK]  55.02,53.67 0 bottom
JP741  [1X01_SMD_3.25X0.85MM_NO_SILK]  14.97,51.23 0 bottom
JP742  [1X01_SMD_3.25X0.85MM_NO_SILK]  19.43,51.23 0 bottom
JP743  [1X01_SMD_3.25X0.85MM_NO_SILK]  23.88,51.23 0 bottom
JP744  [1X01_SMD_3.25X0.85MM_NO_SILK]  28.32,51.23 0 bottom
JP745  [1X01_SMD_3.25X0.85MM_NO_SILK]  32.77,51.23 0 bottom
JP746  [1X01_SMD_3.25X0.85MM_NO_SILK]  37.23,51.23 0 bottom
JP747  [1X01_SMD_3.25X0.85MM_NO_SILK]  41.67,51.23 0 bottom
JP748  [1X01_SMD_3.25X0.85MM_NO_SILK]  46.12,51.23 0 bottom
JP749  [1X01_SMD_3.25X0.85MM_NO_SILK]  50.58,51.23 0 bottom
JP750  [1X01_SMD_3.25X0.85MM_NO_SILK]  55.02,51.23 0 bottom
JP751  [1X01_SMD_3.25X0.85MM_NO_SILK]  14.97,48.77 0 bottom
JP752  [1X01_SMD_3.25X0.85MM_NO_SILK]  19.43,48.77 0 bottom
JP753  [1X01_SMD_3.25X0.85MM_NO_SILK]  23.88,48.77 0 bottom
JP754  [1X01_SMD_3.25X0.85MM_NO_SILK]  28.32,48.77 0 bottom
JP755  [1X01_SMD_3.25X0.85MM_NO_SILK]  32.77,48.77 0 bottom
JP756  [1X01_SMD_3.25X0.85MM_NO_SILK]  37.23,48.77 0 bottom
JP757  [1X01_SMD_3.25X0.85MM_NO_SILK]  41.67,48.77 0 bottom
JP758  [1X01_SMD_3.25X0.85MM_NO_SILK]  46.12,48.77 0 bottom
JP759  [1X01_SMD_3.25X0.85MM_NO_SILK]  50.58,48.77 0 bottom
JP760  [1X01_SMD_3.25X0.85MM_NO_SILK]  55.02,48.77 0 bottom
JP761  [1X01_SMD_3.25X0.85MM_NO_SILK]  14.97,46.33 0 bottom
JP762  [1X01_SMD_3.25X0.85MM_NO_SILK]  19.43,46.33 0 bottom
JP763  [1X01_SMD_3.25X0.85MM_NO_SILK]  23.88,46.33 0 bottom
JP764  [1X01_SMD_3.25X0.85MM_NO_SILK]  28.32,46.33 0 bottom
JP765  [1X01_SMD_3.25X0.85MM_NO_SILK]  32.77,46.33 0 bottom
JP766  [1X01_SMD_3.25X0.85MM_NO_SILK]  37.23,46.33 0 bottom
JP767  [1X01_SMD_3.25X0.85MM_NO_SILK]  41.67,46.33 0 bottom
JP768  [1X01_SMD_3.25X0.85MM_NO_SILK]  46.12,46.33 0 bottom
JP769  [1X01_SMD_3.25X0.85MM_NO_SILK]  50.58,46.33 0 bottom
JP770  [1X01_SMD_3.25X0.85MM_NO_SILK]  55.02,46.33 0 bottom
JP771  [1X01_SMD_3.25X0.85MM_NO_SILK]  14.97,43.88 0 bottom
JP772  [1X01_SMD_3.25X0.85MM_NO_SILK]  19.43,43.88 0 bottom
JP773  [1X01_SMD_3.25X0.85MM_NO_SILK]  23.88,43.88 0 bottom
JP774  [1X01_SMD_3.25X0.85MM_NO_SILK]  28.32,43.88 0 bottom
JP775  [1X01_SMD_3.25X0.85MM_NO_SILK]  32.77,43.88 0 bottom
JP776  [1X01_SMD_3.25X0.85MM_NO_SILK]  37.23,43.88 0 bottom
JP777  [1X01_SMD_3.25X0.85MM_NO_SILK]  41.67,43.88 0 bottom
JP778  [1X01_SMD_3.25X0.85MM_NO_SILK]  46.12,43.88 0 bottom
JP779  [1X01_SMD_3.25X0.85MM_NO_SILK]  50.58,43.88 0 bottom
JP780  [1X01_SMD_3.25X0.85MM_NO_SILK]  55.02,43.88 0 bottom
JP781  [1X01_SMD_3.25X0.85MM_NO_SILK]  14.97,41.42 0 bottom
JP782  [1X01_SMD_3.25X0.85MM_NO_SILK]  19.43,41.42 0 bottom
JP783  [1X01_SMD_3.25X0.85MM_NO_SILK]  23.88,41.42 0 bottom
JP784  [1X01_SMD_3.25X0.85MM_NO_SILK]  28.32,41.42 0 bottom
JP785  [1X01_SMD_3.25X0.85MM_NO_SILK]  32.77,41.42 0 bottom
JP786  [1X01_SMD_3.25X0.85MM_NO_SILK]  37.23,41.42 0 bottom
JP787  [1X01_SMD_3.25X0.85MM_NO_SILK]  41.67,41.42 0 bottom
JP788  [1X01_SMD_3.25X0.85MM_NO_SILK]  46.12,41.42 0 bottom
JP789  [1X01_SMD_3.25X0.85MM_NO_SILK]  50.58,41.42 0 bottom
JP790  [1X01_SMD_3.25X0.85MM_NO_SILK]  55.02,41.42 0 bottom
JP791  [1X01_SMD_3.25X0.85MM_NO_SILK]  14.97,38.98 0 bottom
JP792  [1X01_SMD_3.25X0.85MM_NO_SILK]  19.43,38.98 0 bottom
JP793  [1X01_SMD_3.25X0.85MM_NO_SILK]  23.88,38.98 0 bottom
JP794  [1X01_SMD_3.25X0.85MM_NO_SILK]  28.32,38.98 0 bottom
JP795  [1X01_SMD_3.25X0.85MM_NO_SILK]  32.77,38.98 0 bottom
JP796  [1X01_SMD_3.25X0.85MM_NO_SILK]  37.23,38.98 0 bottom
JP797  [1X01_SMD_3.25X0.85MM_NO_SILK]  41.67,38.98 0 bottom
JP798  [1X01_SMD_3.25X0.85MM_NO_SILK]  46.12,38.98 0 bottom
JP799  [1X01_SMD_3.25X0.85MM_NO_SILK]  50.58,38.98 0 bottom
JP800  [1X01_SMD_3.25X0.85MM_NO_SILK]  55.02,38.98 0 bottom
JP801  [1X01_SMD_3.25X0.85MM_NO_SILK]  14.97,36.52 0 bottom
JP802  [1X01_SMD_3.25X0.85MM_NO_SILK]  19.43,36.52 0 bottom
JP803  [1X01_SMD_3.25X0.85MM_NO_SILK]  23.88,36.52 0 bottom
JP804  [1X01_SMD_3.25X0.85MM_NO_SILK]  28.32,36.52 0 bottom
JP805  [1X01_SMD_3.25X0.85MM_NO_SILK]  32.77,36.52 0 bottom
JP806  [1X01_SMD_3.25X0.85MM_NO_SILK]  37.23,36.52 0 bottom
JP807  [1X01_SMD_3.25X0.85MM_NO_SILK]  41.67,36.52 0 bottom
JP808  [1X01_SMD_3.25X0.85MM_NO_SILK]  46.12,36.52 0 bottom
JP809  [1X01_SMD_3.25X0.85MM_NO_SILK]  50.58,36.52 0 bottom
JP810  [1X01_SMD_3.25X0.85MM_NO_SILK]  55.02,36.52 0 bottom
JP811  [1X01_SMD_3.25X0.85MM_NO_SILK]  14.97,34.08 0 bottom
JP812  [1X01_SMD_3.25X0.85MM_NO_SILK]  19.43,34.08 0 bottom
JP813  [1X01_SMD_3.25X0.85MM_NO_SILK]  23.88,34.08 0 bottom
JP814  [1X01_SMD_3.25X0.85MM_NO_SILK]  28.32,34.08 0 bottom
JP815  [1X01_SMD_3.25X0.85MM_NO_SILK]  32.77,34.08 0 bottom
JP816  [1X01_SMD_3.25X0.85MM_NO_SILK]  37.23,34.08 0 bottom
JP817  [1X01_SMD_3.25X0.85MM_NO_SILK]  41.67,34.08 0 bottom
JP818  [1X01_SMD_3.25X0.85MM_NO_SILK]  46.12,34.08 0 bottom
JP819  [1X01_SMD_3.25X0.85MM_NO_SILK]  50.58,34.08 0 bottom
JP820  [1X01_SMD_3.25X0.85MM_NO_SILK]  55.02,34.08 0 bottom
JP821  [1X01_SMD_3.25X0.85MM_NO_SILK]  14.97,31.62 0 bottom
JP822  [1X01_SMD_3.25X0.85MM_NO_SILK]  19.43,31.62 0 bottom
JP823  [1X01_SMD_3.25X0.85MM_NO_SILK]  23.88,31.62 0 bottom
JP824  [1X01_SMD_3.25X0.85MM_NO_SILK]  28.32,31.62 0 bottom
JP825  [1X01_SMD_3.25X0.85MM_NO_SILK]  32.77,31.62 0 bottom
JP826  [1X01_SMD_3.25X0.85MM_NO_SILK]  37.23,31.62 0 bottom
JP827  [1X01_SMD_3.25X0.85MM_NO_SILK]  41.67,31.62 0 bottom
JP828  [1X01_SMD_3.25X0.85MM_NO_SILK]  46.12,31.62 0 bottom
JP829  [1X01_SMD_3.25X0.85MM_NO_SILK]  50.58,31.62 0 bottom
JP830  [1X01_SMD_3.25X0.85MM_NO_SILK]  55.02,31.62 0 bottom
JP831  [1X01_SMD_3.25X0.85MM_NO_SILK]  14.97,29.18 0 bottom
JP832  [1X01_SMD_3.25X0.85MM_NO_SILK]  19.43,29.18 0 bottom
JP833  [1X01_SMD_3.25X0.85MM_NO_SILK]  23.88,29.18 0 bottom
JP834  [1X01_SMD_3.25X0.85MM_NO_SILK]  28.32,29.18 0 bottom
JP835  [1X01_SMD_3.25X0.85MM_NO_SILK]  32.77,29.18 0 bottom
JP836  [1X01_SMD_3.25X0.85MM_NO_SILK]  37.23,29.18 0 bottom
JP837  [1X01_SMD_3.25X0.85MM_NO_SILK]  41.67,29.18 0 bottom
JP838  [1X01_SMD_3.25X0.85MM_NO_SILK]  46.12,29.18 0 bottom
JP839  [1X01_SMD_3.25X0.85MM_NO_SILK]  50.58,29.18 0 bottom
JP840  [1X01_SMD_3.25X0.85MM_NO_SILK]  55.02,29.18 0 bottom
JP841  [1X01_SMD_3.25X0.85MM_NO_SILK]  14.97,26.73 0 bottom
JP842  [1X01_SMD_3.25X0.85MM_NO_SILK]  19.43,26.73 0 bottom
JP843  [1X01_SMD_3.25X0.85MM_NO_SILK]  23.88,26.73 0 bottom
JP844  [1X01_SMD_3.25X0.85MM_NO_SILK]  28.32,26.73 0 bottom
JP845  [1X01_SMD_3.25X0.85MM_NO_SILK]  32.77,26.73 0 bottom
JP846  [1X01_SMD_3.25X0.85MM_NO_SILK]  37.23,26.73 0 bottom
JP847  [1X01_SMD_3.25X0.85MM_NO_SILK]  41.67,26.73 0 bottom
JP848  [1X01_SMD_3.25X0.85MM_NO_SILK]  46.12,26.73 0 bottom
JP849  [1X01_SMD_3.25X0.85MM_NO_SILK]  50.58,26.73 0 bottom
JP850  [1X01_SMD_3.25X0.85MM_NO_SILK]  55.02,26.73 0 bottom
JP851  [1X01_SMD_3.25X0.85MM_NO_SILK]  14.97,24.27 0 bottom
JP852  [1X01_SMD_3.25X0.85MM_NO_SILK]  19.43,24.27 0 bottom
JP853  [1X01_SMD_3.25X0.85MM_NO_SILK]  23.88,24.27 0 bottom
JP854  [1X01_SMD_3.25X0.85MM_NO_SILK]  28.32,24.27 0 bottom
JP855  [1X01_SMD_3.25X0.85MM_NO_SILK]  32.77,24.27 0 bottom
JP856  [1X01_SMD_3.25X0.85MM_NO_SILK]  37.23,24.27 0 bottom
JP857  [1X01_SMD_3.25X0.85MM_NO_SILK]  41.67,24.27 0 bottom
JP858  [1X01_SMD_3.25X0.85MM_NO_SILK]  46.12,24.27 0 bottom
JP859  [1X01_SMD_3.25X0.85MM_NO_SILK]  50.58,24.27 0 bottom
JP860  [1X01_SMD_3.25X0.85MM_NO_SILK]  55.02,24.27 0 bottom
JP861  [1X01_SMD_3.25X0.85MM_NO_SILK]  14.97,21.82 0 bottom
JP862  [1X01_SMD_3.25X0.85MM_NO_SILK]  19.43,21.82 0 bottom
JP863  [1X01_SMD_3.25X0.85MM_NO_SILK]  23.88,21.82 0 bottom
JP864  [1X01_SMD_3.25X0.85MM_NO_SILK]  28.32,21.82 0 bottom
JP865  [1X01_SMD_3.25X0.85MM_NO_SILK]  32.77,21.82 0 bottom
JP866  [1X01_SMD_3.25X0.85MM_NO_SILK]  37.23,21.82 0 bottom
JP867  [1X01_SMD_3.25X0.85MM_NO_SILK]  41.67,21.82 0 bottom
JP868  [1X01_SMD_3.25X0.85MM_NO_SILK]  46.12,21.82 0 bottom
JP869  [1X01_SMD_3.25X0.85MM_NO_SILK]  50.58,21.82 0 bottom
JP870  [1X01_SMD_3.25X0.85MM_NO_SILK]  55.02,21.82 0 bottom
JP871  [1X01_SMD_3.25X0.85MM_NO_SILK]  14.97,19.38 0 bottom
JP872  [1X01_SMD_3.25X0.85MM_NO_SILK]  19.43,19.38 0 bottom
JP873  [1X01_SMD_3.25X0.85MM_NO_SILK]  23.88,19.38 0 bottom
JP874  [1X01_SMD_3.25X0.85MM_NO_SILK]  28.32,19.38 0 bottom
JP875  [1X01_SMD_3.25X0.85MM_NO_SILK]  32.77,19.38 0 bottom
JP876  [1X01_SMD_3.25X0.85MM_NO_SILK]  37.23,19.38 0 bottom
JP877  [1X01_SMD_3.25X0.85MM_NO_SILK]  41.67,19.38 0 bottom
JP878  [1X01_SMD_3.25X0.85MM_NO_SILK]  46.12,19.38 0 bottom
JP879  [1X01_SMD_3.25X0.85MM_NO_SILK]  50.58,19.38 0 bottom
JP880  [1X01_SMD_3.25X0.85MM_NO_SILK]  55.02,19.38 0 bottom
JP881  [1X01_SMD_3.25X0.85MM_NO_SILK]  14.97,16.93 0 bottom
JP882  [1X01_SMD_3.25X0.85MM_NO_SILK]  19.43,16.93 0 bottom
JP883  [1X01_SMD_3.25X0.85MM_NO_SILK]  23.88,16.93 0 bottom
JP884  [1X01_SMD_3.25X0.85MM_NO_SILK]  28.32,16.93 0 bottom
JP885  [1X01_SMD_3.25X0.85MM_NO_SILK]  32.77,16.93 0 bottom
JP886  [1X01_SMD_3.25X0.85MM_NO_SILK]  37.23,16.93 0 bottom
JP887  [1X01_SMD_3.25X0.85MM_NO_SILK]  41.67,16.93 0 bottom
JP888  [1X01_SMD_3.25X0.85MM_NO_SILK]  46.12,16.93 0 bottom
JP889  [1X01_SMD_3.25X0.85MM_NO_SILK]  50.58,16.93 0 bottom
JP890  [1X01_SMD_3.25X0.85MM_NO_SILK]  55.02,16.93 0 bottom
JP891  [1X01_SMD_3.25X0.85MM_NO_SILK]  14.97,14.47 0 bottom
JP892  [1X01_SMD_3.25X0.85MM_NO_SILK]  19.43,14.47 0 bottom
JP893  [1X01_SMD_3.25X0.85MM_NO_SILK]  23.88,14.47 0 bottom
JP894  [1X01_SMD_3.25X0.85MM_NO_SILK]  28.32,14.47 0 bottom
JP895  [1X01_SMD_3.25X0.85MM_NO_SILK]  32.77,14.47 0 bottom
JP896  [1X01_SMD_3.25X0.85MM_NO_SILK]  37.23,14.47 0 bottom
JP897  [1X01_SMD_3.25X0.85MM_NO_SILK]  41.67,14.47 0 bottom
JP898  [1X01_SMD_3.25X0.85MM_NO_SILK]  46.12,14.47 0 bottom
JP899  [1X01_SMD_3.25X0.85MM_NO_SILK]  50.58,14.47 0 bottom
JP900  [1X01_SMD_3.25X0.85MM_NO_SILK]  55.02,14.47 0 bottom
JP901  [1X01_SMD_3.25X0.85MM_NO_SILK]  3,87.47 0 top
JP902  [1X01_SMD_3.25X0.85MM_NO_SILK]  3,86.19 0 top
JP903  [1X01_SMD_3.25X0.85MM_NO_SILK]  3,84.92 0 top
JP904  [1X01_SMD_3.25X0.85MM_NO_SILK]  3,83.66 0 top
JP905  [1X01_SMD_3.25X0.85MM_NO_SILK]  3,82.39 0 top
JP906  [1X01_SMD_3.25X0.85MM_NO_SILK]  3,81.11 0 top
JP907  [1X01_SMD_3.25X0.85MM_NO_SILK]  3,79.84 0 top
JP908  [1X01_SMD_3.25X0.85MM_NO_SILK]  3,78.58 0 top
JP909  [1X01_SMD_3.25X0.85MM_NO_SILK]  3,77.31 0 top
JP910  [1X01_SMD_3.25X0.85MM_NO_SILK]  3,76.03 0 top
JP911  [1X01_SMD_3.25X0.85MM_NO_SILK]  3,74.77 0 top
JP912  [1X01_SMD_3.25X0.85MM_NO_SILK]  3,73.5 0 top
JP913  [1X01_SMD_3.25X0.85MM_NO_SILK]  3,72.22 0 top
JP914  [1X01_SMD_3.25X0.85MM_NO_SILK]  3,70.95 0 top
JP915  [1X01_SMD_3.25X0.85MM_NO_SILK]  3,69.69 0 top
JP916  [1X01_SMD_3.25X0.85MM_NO_SILK]  3,68.42 0 top
JP917  [1X01_SMD_3.25X0.85MM_NO_SILK]  3,67.14 0 top
JP918  [1X01_SMD_3.25X0.85MM_NO_SILK]  3,65.88 0 top
JP919  [1X01_SMD_3.25X0.85MM_NO_SILK]  3,64.61 0 top
JP920  [1X01_SMD_3.25X0.85MM_NO_SILK]  3,63.34 0 top
JP921  [1X01_SMD_3.25X0.85MM_NO_SILK]  3,62.06 0 top
JP922  [1X01_SMD_3.25X0.85MM_NO_SILK]  3,60.8 0 top
JP923  [1X01_SMD_3.25X0.85MM_NO_SILK]  3,59.52 0 top
JP924  [1X01_SMD_3.25X0.85MM_NO_SILK]  3,58.26 0 top
JP925  [1X01_SMD_3.25X0.85MM_NO_SILK]  3,56.98 0 top
JP926  [1X01_SMD_3.25X0.85MM_NO_SILK]  3,55.72 0 top
JP927  [1X01_SMD_3.25X0.85MM_NO_SILK]  3,54.45 0 top
JP928  [1X01_SMD_3.25X0.85MM_NO_SILK]  3,53.17 0 top
JP929  [1X01_SMD_3.25X0.85MM_NO_SILK]  3,51.91 0 top
JP930  [1X01_SMD_3.25X0.85MM_NO_SILK]  3,50.63 0 top
JP931  [1X01_SMD_3.25X0.85MM_NO_SILK]  3,49.37 0 top
JP932  [1X01_SMD_3.25X0.85MM_NO_SILK]  3,48.09 0 top
JP933  [1X01_SMD_3.25X0.85MM_NO_SILK]  3,46.83 0 top
JP934  [1X01_SMD_3.25X0.85MM_NO_SILK]  3,45.55 0 top
JP935  [1X01_SMD_3.25X0.85MM_NO_SILK]  3,44.28 0 top
JP936  [1X01_SMD_3.25X0.85MM_NO_SILK]  3,43.02 0 top
JP937  [1X01_SMD_3.25X0.85MM_NO_SILK]  3,41.74 0 top
JP938  [1X01_SMD_3.25X0.85MM_NO_SILK]  3,40.48 0 top
JP939  [1X01_SMD_3.25X0.85MM_NO_SILK]  3,39.2 0 top
JP940  [1X01_SMD_3.25X0.85MM_NO_SILK]  3,37.94 0 top
JP941  [1X01_SMD_3.25X0.85MM_NO_SILK]  3,36.66 0 top
JP942  [1X01_SMD_3.25X0.85MM_NO_SILK]  3,35.4 0 top
JP943  [1X01_SMD_3.25X0.85MM_NO_SILK]  3,34.12 0 top
JP944  [1X01_SMD_3.25X0.85MM_NO_SILK]  3,32.85 0 top
JP945  [1X01_SMD_3.25X0.85MM_NO_SILK]  3,31.59 0 top
JP946  [1X01_SMD_3.25X0.85MM_NO_SILK]  3,30.32 0 top
JP947  [1X01_SMD_3.25X0.85MM_NO_SILK]  3,29.05 0 top
JP948  [1X01_SMD_3.25X0.85MM_NO_SILK]  3,27.77 0 top
JP949  [1X01_SMD_3.25X0.85MM_NO_SILK]  3,26.5 0 top
JP950  [1X01_SMD_3.25X0.85MM_NO_SILK]  3,25.23 0 top
JP951  [1X01_SMD_3.25X0.85MM_NO_SILK]  3,23.96 0 top
JP952  [1X01_SMD_3.25X0.85MM_NO_SILK]  3,22.7 0 top
JP953  [1X01_SMD_3.25X0.85MM_NO_SILK]  3,21.43 0 top
JP954  [1X01_SMD_3.25X0.85MM_NO_SILK]  3,20.16 0 top
JP955  [1X01_SMD_3.25X0.85MM_NO_SILK]  3,18.89 0 top
JP956  [1X01_SMD_3.25X0.85MM_NO_SILK]  3,17.61 0 top
JP957  [1X01_SMD_3.25X0.85MM_NO_SILK]  3,16.34 0 top
JP958  [1X01_SMD_3.25X0.85MM_NO_SILK]  3,15.07 0 top
JP959  [1X01_SMD_3.25X0.85MM_NO_SILK]  3,13.8 0 top
JP960  [1X01_SMD_3.25X0.85MM_NO_SILK]  3,12.54 0 top
JP961  [1X01_SMD_3.25X0.85MM_NO_SILK]  7.5,87.47 0 top
JP962  [1X01_SMD_3.25X0.85MM_NO_SILK]  7.5,86.19 0 top
JP963  [1X01_SMD_3.25X0.85MM_NO_SILK]  7.5,84.92 0 top
JP964  [1X01_SMD_3.25X0.85MM_NO_SILK]  7.5,83.66 0 top
JP965  [1X01_SMD_3.25X0.85MM_NO_SILK]  7.5,82.39 0 top
JP966  [1X01_SMD_3.25X0.85MM_NO_SILK]  7.5,81.11 0 top
JP967  [1X01_SMD_3.25X0.85MM_NO_SILK]  7.5,79.84 0 top
JP968  [1X01_SMD_3.25X0.85MM_NO_SILK]  7.5,78.58 0 top
JP969  [1X01_SMD_3.25X0.85MM_NO_SILK]  7.5,77.31 0 top
JP970  [1X01_SMD_3.25X0.85MM_NO_SILK]  7.5,76.03 0 top
JP971  [1X01_SMD_3.25X0.85MM_NO_SILK]  7.5,74.77 0 top
JP972  [1X01_SMD_3.25X0.85MM_NO_SILK]  7.5,73.5 0 top
JP973  [1X01_SMD_3.25X0.85MM_NO_SILK]  7.5,72.22 0 top
JP974  [1X01_SMD_3.25X0.85MM_NO_SILK]  7.5,70.95 0 top
JP975  [1X01_SMD_3.25X0.85MM_NO_SILK]  7.5,69.69 0 top
JP976  [1X01_SMD_3.25X0.85MM_NO_SILK]  7.5,68.42 0 top
JP977  [1X01_SMD_3.25X0.85MM_NO_SILK]  7.5,67.14 0 top
JP978  [1X01_SMD_3.25X0.85MM_NO_SILK]  7.5,65.88 0 top
JP979  [1X01_SMD_3.25X0.85MM_NO_SILK]  7.5,64.61 0 top
JP980  [1X01_SMD_3.25X0.85MM_NO_SILK]  7.5,63.34 0 top
JP981  [1X01_SMD_3.25X0.85MM_NO_SILK]  7.5,62.06 0 top
JP982  [1X01_SMD_3.25X0.85MM_NO_SILK]  7.5,60.8 0 top
JP983  [1X01_SMD_3.25X0.85MM_NO_SILK]  7.5,59.52 0 top
JP984  [1X01_SMD_3.25X0.85MM_NO_SILK]  7.5,58.26 0 top
JP985  [1X01_SMD_3.25X0.85MM_NO_SILK]  7.5,56.98 0 top
JP986  [1X01_SMD_3.25X0.85MM_NO_SILK]  7.5,55.72 0 top
JP987  [1X01_SMD_3.25X0.85MM_NO_SILK]  7.5,54.45 0 top
JP988  [1X01_SMD_3.25X0.85MM_NO_SILK]  7.5,53.17 0 top
JP989  [1X01_SMD_3.25X0.85MM_NO_SILK]  7.5,51.91 0 top
JP990  [1X01_SMD_3.25X0.85MM_NO_SILK]  7.5,50.63 0 top
JP991  [1X01_SMD_3.25X0.85MM_NO_SILK]  7.5,49.37 0 top
JP992  [1X01_SMD_3.25X0.85MM_NO_SILK]  7.5,48.09 0 top
JP993  [1X01_SMD_3.25X0.85MM_NO_SILK]  7.5,46.83 0 top
JP994  [1X01_SMD_3.25X0.85MM_NO_SILK]  7.5,45.55 0 top
JP995  [1X01_SMD_3.25X0.85MM_NO_SILK]  7.5,44.28 0 top
JP996  [1X01_SMD_3.25X0.85MM_NO_SILK]  7.5,43.02 0 top
JP997  [1X01_SMD_3.25X0.85MM_NO_SILK]  7.5,41.74 0 top
JP998  [1X01_SMD_3.25X0.85MM_NO_SILK]  7.5,40.48 0 top
JP999  [1X01_SMD_3.25X0.85MM_NO_SILK]  7.5,39.2 0 top
JP1000  [1X01_SMD_3.25X0.85MM_NO_SILK]  7.5,37.94 0 top
JP1001  [1X01_SMD_3.25X0.85MM_NO_SILK]  7.5,36.66 0 top
JP1002  [1X01_SMD_3.25X0.85MM_NO_SILK]  7.5,35.4 0 top
JP1003  [1X01_SMD_3.25X0.85MM_NO_SILK]  7.5,34.12 0 top
JP1004  [1X01_SMD_3.25X0.85MM_NO_SILK]  7.5,32.85 0 top
JP1005  [1X01_SMD_3.25X0.85MM_NO_SILK]  7.5,31.59 0 top
JP1006  [1X01_SMD_3.25X0.85MM_NO_SILK]  7.5,30.32 0 top
JP1007  [1X01_SMD_3.25X0.85MM_NO_SILK]  7.5,29.05 0 top
JP1008  [1X01_SMD_3.25X0.85MM_NO_SILK]  7.5,27.77 0 top
JP1009  [1X01_SMD_3.25X0.85MM_NO_SILK]  7.5,26.5 0 top
JP1010  [1X01_SMD_3.25X0.85MM_NO_SILK]  7.5,25.23 0 top
JP1011  [1X01_SMD_3.25X0.85MM_NO_SILK]  7.5,23.96 0 top
JP1012  [1X01_SMD_3.25X0.85MM_NO_SILK]  7.5,22.7 0 top
JP1013  [1X01_SMD_3.25X0.85MM_NO_SILK]  7.5,21.43 0 top
JP1014  [1X01_SMD_3.25X0.85MM_NO_SILK]  7.5,20.16 0 top
JP1015  [1X01_SMD_3.25X0.85MM_NO_SILK]  7.5,18.89 0 top
JP1016  [1X01_SMD_3.25X0.85MM_NO_SILK]  7.5,17.61 0 top
JP1017  [1X01_SMD_3.25X0.85MM_NO_SILK]  7.5,16.34 0 top
JP1018  [1X01_SMD_3.25X0.85MM_NO_SILK]  7.5,15.07 0 top
JP1019  [1X01_SMD_3.25X0.85MM_NO_SILK]  7.5,13.8 0 top
JP1020  [1X01_SMD_3.25X0.85MM_NO_SILK]  7.5,12.54 0 top
JP1021  [1X01_SMD_3.25X0.85MM_NO_SILK]  62.5,87.47 0 top
JP1022  [1X01_SMD_3.25X0.85MM_NO_SILK]  62.5,86.19 0 top
JP1023  [1X01_SMD_3.25X0.85MM_NO_SILK]  62.5,84.92 0 top
JP1024  [1X01_SMD_3.25X0.85MM_NO_SILK]  62.5,83.66 0 top
JP1025  [1X01_SMD_3.25X0.85MM_NO_SILK]  62.5,82.39 0 top
JP1026  [1X01_SMD_3.25X0.85MM_NO_SILK]  62.5,81.11 0 top
JP1027  [1X01_SMD_3.25X0.85MM_NO_SILK]  62.5,79.84 0 top
JP1028  [1X01_SMD_3.25X0.85MM_NO_SILK]  62.5,78.58 0 top
JP1029  [1X01_SMD_3.25X0.85MM_NO_SILK]  62.5,77.31 0 top
JP1030  [1X01_SMD_3.25X0.85MM_NO_SILK]  62.5,76.03 0 top
JP1031  [1X01_SMD_3.25X0.85MM_NO_SILK]  62.5,74.77 0 top
JP1032  [1X01_SMD_3.25X0.85MM_NO_SILK]  62.5,73.5 0 top
JP1033  [1X01_SMD_3.25X0.85MM_NO_SILK]  62.5,72.22 0 top
JP1034  [1X01_SMD_3.25X0.85MM_NO_SILK]  62.5,70.95 0 top
JP1035  [1X01_SMD_3.25X0.85MM_NO_SILK]  62.5,69.69 0 top
JP1036  [1X01_SMD_3.25X0.85MM_NO_SILK]  62.5,68.42 0 top
JP1037  [1X01_SMD_3.25X0.85MM_NO_SILK]  62.5,67.14 0 top
JP1038  [1X01_SMD_3.25X0.85MM_NO_SILK]  62.5,65.88 0 top
JP1039  [1X01_SMD_3.25X0.85MM_NO_SILK]  62.5,64.61 0 top
JP1040  [1X01_SMD_3.25X0.85MM_NO_SILK]  62.5,63.34 0 top
JP1041  [1X01_SMD_3.25X0.85MM_NO_SILK]  62.5,62.06 0 top
JP1042  [1X01_SMD_3.25X0.85MM_NO_SILK]  62.5,60.8 0 top
JP1043  [1X01_SMD_3.25X0.85MM_NO_SILK]  62.5,59.52 0 top
JP1044  [1X01_SMD_3.25X0.85MM_NO_SILK]  62.5,58.26 0 top
JP1045  [1X01_SMD_3.25X0.85MM_NO_SILK]  62.5,56.98 0 top
JP1046  [1X01_SMD_3.25X0.85MM_NO_SILK]  62.5,55.72 0 top
JP1047  [1X01_SMD_3.25X0.85MM_NO_SILK]  62.5,54.45 0 top
JP1048  [1X01_SMD_3.25X0.85MM_NO_SILK]  62.5,53.17 0 top
JP1049  [1X01_SMD_3.25X0.85MM_NO_SILK]  62.5,51.91 0 top
JP1050  [1X01_SMD_3.25X0.85MM_NO_SILK]  62.5,50.63 0 top
JP1051  [1X01_SMD_3.25X0.85MM_NO_SILK]  62.5,49.37 0 top
JP1052  [1X01_SMD_3.25X0.85MM_NO_SILK]  62.5,48.09 0 top
JP1053  [1X01_SMD_3.25X0.85MM_NO_SILK]  62.5,46.83 0 top
JP1054  [1X01_SMD_3.25X0.85MM_NO_SILK]  62.5,45.55 0 top
JP1055  [1X01_SMD_3.25X0.85MM_NO_SILK]  62.5,44.28 0 top
JP1056  [1X01_SMD_3.25X0.85MM_NO_SILK]  62.5,43.02 0 top
JP1057  [1X01_SMD_3.25X0.85MM_NO_SILK]  62.5,41.74 0 top
JP1058  [1X01_SMD_3.25X0.85MM_NO_SILK]  62.5,40.48 0 top
JP1059  [1X01_SMD_3.25X0.85MM_NO_SILK]  62.5,39.2 0 top
JP1060  [1X01_SMD_3.25X0.85MM_NO_SILK]  62.5,37.94 0 top
JP1061  [1X01_SMD_3.25X0.85MM_NO_SILK]  62.5,36.66 0 top
JP1062  [1X01_SMD_3.25X0.85MM_NO_SILK]  62.5,35.4 0 top
JP1063  [1X01_SMD_3.25X0.85MM_NO_SILK]  62.5,34.12 0 top
JP1064  [1X01_SMD_3.25X0.85MM_NO_SILK]  62.5,32.85 0 top
JP1065  [1X01_SMD_3.25X0.85MM_NO_SILK]  62.5,31.59 0 top
JP1066  [1X01_SMD_3.25X0.85MM_NO_SILK]  62.5,30.32 0 top
JP1067  [1X01_SMD_3.25X0.85MM_NO_SILK]  62.5,29.05 0 top
JP1068  [1X01_SMD_3.25X0.85MM_NO_SILK]  62.5,27.77 0 top
JP1069  [1X01_SMD_3.25X0.85MM_NO_SILK]  62.5,26.5 0 top
JP1070  [1X01_SMD_3.25X0.85MM_NO_SILK]  62.5,25.23 0 top
JP1071  [1X01_SMD_3.25X0.85MM_NO_SILK]  62.5,23.96 0 top
JP1072  [1X01_SMD_3.25X0.85MM_NO_SILK]  62.5,22.7 0 top
JP1073  [1X01_SMD_3.25X0.85MM_NO_SILK]  62.5,21.43 0 top
JP1074  [1X01_SMD_3.25X0.85MM_NO_SILK]  62.5,20.16 0 top
JP1075  [1X01_SMD_3.25X0.85MM_NO_SILK]  62.5,18.89 0 top
JP1076  [1X01_SMD_3.25X0.85MM_NO_SILK]  62.5,17.61 0 top
JP1077  [1X01_SMD_3.25X0.85MM_NO_SILK]  62.5,16.34 0 top
JP1078  [1X01_SMD_3.25X0.85MM_NO_SILK]  62.5,15.07 0 top
JP1079  [1X01_SMD_3.25X0.85MM_NO_SILK]  62.5,13.8 0 top
JP1080  [1X01_SMD_3.25X0.85MM_NO_SILK]  62.5,12.54 0 top
JP1081  [1X01_SMD_3.25X0.85MM_NO_SILK]  67,87.47 0 top
JP1082  [1X01_SMD_3.25X0.85MM_NO_SILK]  67,86.19 0 top
JP1083  [1X01_SMD_3.25X0.85MM_NO_SILK]  67,84.92 0 top
JP1084  [1X01_SMD_3.25X0.85MM_NO_SILK]  67,83.66 0 top
JP1085  [1X01_SMD_3.25X0.85MM_NO_SILK]  67,82.39 0 top
JP1086  [1X01_SMD_3.25X0.85MM_NO_SILK]  67,81.11 0 top
JP1087  [1X01_SMD_3.25X0.85MM_NO_SILK]  67,79.84 0 top
JP1088  [1X01_SMD_3.25X0.85MM_NO_SILK]  67,78.58 0 top
JP1089  [1X01_SMD_3.25X0.85MM_NO_SILK]  67,77.31 0 top
JP1090  [1X01_SMD_3.25X0.85MM_NO_SILK]  67,76.03 0 top
JP1091  [1X01_SMD_3.25X0.85MM_NO_SILK]  67,74.77 0 top
JP1092  [1X01_SMD_3.25X0.85MM_NO_SILK]  67,73.5 0 top
JP1093  [1X01_SMD_3.25X0.85MM_NO_SILK]  67,72.22 0 top
JP1094  [1X01_SMD_3.25X0.85MM_NO_SILK]  67,70.95 0 top
JP1095  [1X01_SMD_3.25X0.85MM_NO_SILK]  67,69.69 0 top
JP1096  [1X01_SMD_3.25X0.85MM_NO_SILK]  67,68.42 0 top
JP1097  [1X01_SMD_3.25X0.85MM_NO_SILK]  67,67.14 0 top
JP1098  [1X01_SMD_3.25X0.85MM_NO_SILK]  67,65.88 0 top
JP1099  [1X01_SMD_3.25X0.85MM_NO_SILK]  67,64.61 0 top
JP1100  [1X01_SMD_3.25X0.85MM_NO_SILK]  67,63.34 0 top
JP1101  [1X01_SMD_3.25X0.85MM_NO_SILK]  67,62.06 0 top
JP1102  [1X01_SMD_3.25X0.85MM_NO_SILK]  67,60.8 0 top
JP1103  [1X01_SMD_3.25X0.85MM_NO_SILK]  67,59.52 0 top
JP1104  [1X01_SMD_3.25X0.85MM_NO_SILK]  67,58.26 0 top
JP1105  [1X01_SMD_3.25X0.85MM_NO_SILK]  67,56.98 0 top
JP1106  [1X01_SMD_3.25X0.85MM_NO_SILK]  67,55.72 0 top
JP1107  [1X01_SMD_3.25X0.85MM_NO_SILK]  67,54.45 0 top
JP1108  [1X01_SMD_3.25X0.85MM_NO_SILK]  67,53.17 0 top
JP1109  [1X01_SMD_3.25X0.85MM_NO_SILK]  67,51.91 0 top
JP1110  [1X01_SMD_3.25X0.85MM_NO_SILK]  67,50.63 0 top
JP1111  [1X01_SMD_3.25X0.85MM_NO_SILK]  67,49.37 0 top
JP1112  [1X01_SMD_3.25X0.85MM_NO_SILK]  67,48.09 0 top
JP1113  [1X01_SMD_3.25X0.85MM_NO_SILK]  67,46.83 0 top
JP1114  [1X01_SMD_3.25X0.85MM_NO_SILK]  67,45.55 0 top
JP1115  [1X01_SMD_3.25X0.85MM_NO_SILK]  67,44.28 0 top
JP1116  [1X01_SMD_3.25X0.85MM_NO_SILK]  67,43.02 0 top
JP1117  [1X01_SMD_3.25X0.85MM_NO_SILK]  67,41.74 0 top
JP1118  [1X01_SMD_3.25X0.85MM_NO_SILK]  67,40.48 0 top
JP1119  [1X01_SMD_3.25X0.85MM_NO_SILK]  67,39.2 0 top
JP1120  [1X01_SMD_3.25X0.85MM_NO_SILK]  67,37.94 0 top
JP1121  [1X01_SMD_3.25X0.85MM_NO_SILK]  67,36.66 0 top
JP1122  [1X01_SMD_3.25X0.85MM_NO_SILK]  67,35.4 0 top
JP1123  [1X01_SMD_3.25X0.85MM_NO_SILK]  67,34.12 0 top
JP1124  [1X01_SMD_3.25X0.85MM_NO_SILK]  67,32.85 0 top
JP1125  [1X01_SMD_3.25X0.85MM_NO_SILK]  67,31.59 0 top
JP1126  [1X01_SMD_3.25X0.85MM_NO_SILK]  67,30.32 0 top
JP1127  [1X01_SMD_3.25X0.85MM_NO_SILK]  67,29.05 0 top
JP1128  [1X01_SMD_3.25X0.85MM_NO_SILK]  67,27.77 0 top
JP1129  [1X01_SMD_3.25X0.85MM_NO_SILK]  67,26.5 0 top
JP1130  [1X01_SMD_3.25X0.85MM_NO_SILK]  67,25.23 0 top
JP1131  [1X01_SMD_3.25X0.85MM_NO_SILK]  67,23.96 0 top
JP1132  [1X01_SMD_3.25X0.85MM_NO_SILK]  67,22.7 0 top
JP1133  [1X01_SMD_3.25X0.85MM_NO_SILK]  67,21.43 0 top
JP1134  [1X01_SMD_3.25X0.85MM_NO_SILK]  67,20.16 0 top
JP1135  [1X01_SMD_3.25X0.85MM_NO_SILK]  67,18.89 0 top
JP1136  [1X01_SMD_3.25X0.85MM_NO_SILK]  67,17.61 0 top
JP1137  [1X01_SMD_3.25X0.85MM_NO_SILK]  67,16.34 0 top
JP1138  [1X01_SMD_3.25X0.85MM_NO_SILK]  67,15.07 0 top
JP1139  [1X01_SMD_3.25X0.85MM_NO_SILK]  67,13.8 0 top
JP1140  [1X01_SMD_3.25X0.85MM_NO_SILK]  67,12.54 0 top
JP1141  [1X01_SMD_3.25X0.85MM_NO_SILK]  16.59,97 270 top
JP1142  [1X01_SMD_3.25X0.85MM_NO_SILK]  17.86,97 270 top
JP1143  [1X01_SMD_3.25X0.85MM_NO_SILK]  19.12,97 270 top
JP1144  [1X01_SMD_3.25X0.85MM_NO_SILK]  20.39,97 270 top
JP1145  [1X01_SMD_3.25X0.85MM_NO_SILK]  21.66,97 270 top
JP1146  [1X01_SMD_3.25X0.85MM_NO_SILK]  22.93,97 270 top